# EAGLE design MJ818 rev.5b - SN Mini2 (EAGLE 9.6.2)
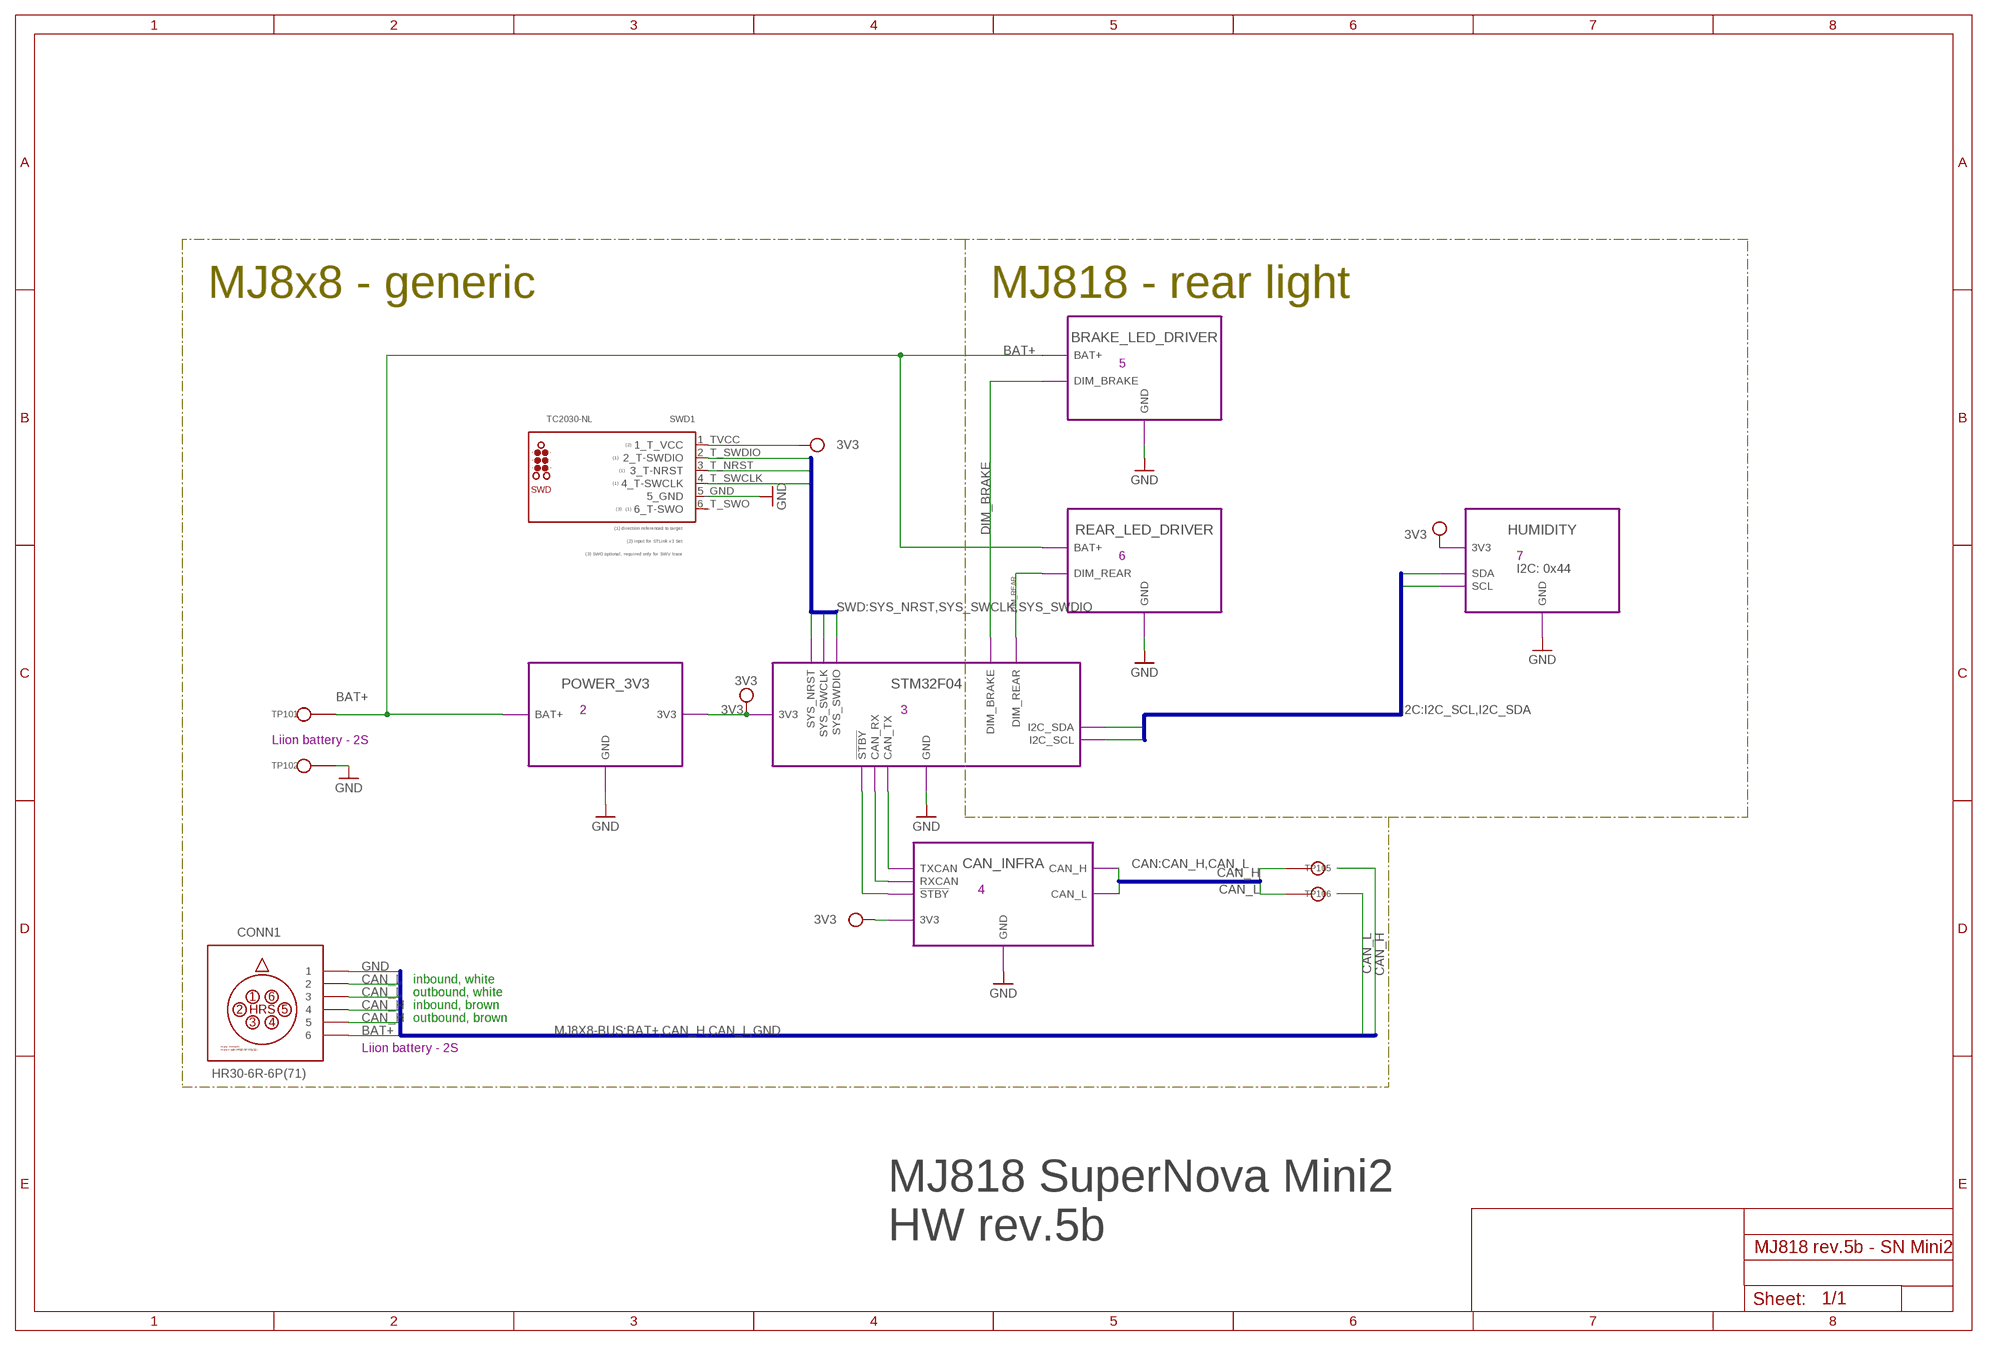
[diagram p0: schematic, sheet 1]

## Parts
CONN1  HR30-6R-6P(71)  HR-30-6R-6X  (no package)
SWD1  TC2030-NL  TC2030  [TC2030-NL]
TP101  LiIon + Terminal  TPTH-0.9  [TH-0.9]
TP102  LiIon - Terminal  TPTH-0.9  [TH-0.9]
TP105  CAN high  TPTH-0.9  [TH-0.9]
TP106  CAN low  TPTH-0.9  [TH-0.9]

## Module instances
POWER_3V3 = POWER_3V3 (part numbers offset by 200)
STM32F04 = STM32 (part numbers offset by 300)
CAN_INFRA = CAN_INFRA (part numbers offset by 400)
BRAKE_LED_DRIVER = LED_DRIVER_BRAKE-LIGHT (part numbers offset by 500)
REAR_LED_DRIVER = LED_DRIVER_REAR-LIGHT (part numbers offset by 600)
HUMIDITY = HUMIDITY (part numbers offset by 700)

## Nets
3V3 [3V3]: SWD1.1_TVCC(1_T_VCC) ; port STM32F04.3V3 POWER_3V3.3V3 CAN_INFRA.3V3 HUMIDITY.3V3
!STBY! [signal]: port CAN_INFRA.!STBY! STM32F04.!STBY!
BAT+ [BAT+]: CONN1.6 TP101.P$1(TP$1) ; port POWER_3V3.BAT+ BRAKE_LED_DRIVER.BAT+ REAR_LED_DRIVER.BAT+
CAN_H [signal]: CONN1.4 CONN1.5 TP105.P$1(TP$1) ; port CAN_INFRA.CAN_H
CAN_L [signal]: CONN1.2 CONN1.3 TP106.P$1(TP$1) ; port CAN_INFRA.CAN_L
CAN_RX [signal]: port CAN_INFRA.RXCAN STM32F04.CAN_RX
CAN_TX [signal]: port CAN_INFRA.TXCAN STM32F04.CAN_TX
DIM_BRAKE [signal]: port STM32F04.DIM_BRAKE BRAKE_LED_DRIVER.DIM_BRAKE
DIM_REAR [signal]: port STM32F04.DIM_REAR REAR_LED_DRIVER.DIM_REAR
GND: CONN1.1 SWD1.5_GND TP102.P$1(TP$1) ; port STM32F04.GND POWER_3V3.GND CAN_INFRA.GND BRAKE_LED_DRIVER.GND REAR_LED_DRIVER.GND HUMIDITY.GND
I2C_SCL [signal]: port STM32F04.I2C_SCL HUMIDITY.SCL
I2C_SDA [signal]: port STM32F04.I2C_SDA HUMIDITY.SDA
SYS_NRST [signal]: SWD1.3_T_NRST(3_T-NRST) ; port STM32F04.SYS_NRST
SYS_SWCLK [signal]: SWD1.4_T_SWCLK(4_T-SWCLK) ; port STM32F04.SYS_SWCLK
SYS_SWDIO [signal]: SWD1.2_T_SWDIO(2_T-SWDIO) ; port STM32F04.SYS_SWDIO
Unconnected: SWD1.6_T_SWO(6_T-SWO)

## Buses
CAN:CAN_H,CAN_L
SWD:SYS_NRST,SYS_SWCLK,SYS_SWDIO
MJ8X8-BUS:BAT+,CAN_H,CAN_L,GND
I2C:I2C_SCL,I2C_SDA

## Notes on the sheet
- MJ8x8 - generic | MJ818 - rear light
- 5
- 6 | 7
- I2C: 0x44
- 2 | 3
- Liion battery - 2S
- 4
- inbound, white
- outbound, white
- inbound, brown
- outbound, brown
- Liion battery - 2S
- MJ818 SuperNova Mini2
  HW rev.5b

## Library data of the parts
CONN1 = HR30-6R-6P - PushPull Receptacle:HR-30-6R-6X
SWD1 = tag-connect:TC2030: TC2030 pad no. Function STLink v3 CN1 pin no. Function 1 Reserved (1) 2 Reserved (1) 1 T_Vcc 3 T_Vcc (2) 2 T_SWDIO 4 T_JTMS/T_SWDIO 5 GND 4 T_SWCLK 6 T_JCLK / T_SWCLK 5 GND 7 GND 6 8 T_JTDO / T_SWO (3) 9 T_JRCLK (4) / NC (5) 10 T_JTDI / NC (5) 11 GNDDetect (6) 3 T_NRST 12 T_NRST 13 T_VCP_RX (7) 14 T_VCP_TX (2) (1) Do not connect to the target (2) Input for STLINK-V3SET (3) SWO is optional, required only for Serial Wire Viewer (SWV) trace (4) Optional loopback of T_JCLK on the target side, required if loopback is removed on the STLINK-V3SET side (5) NC means not required for the SWD connection (6) Tied to GND by STLINK-V3SET firmware; may be used by the target for detection of the tool (7) Output for STLINK-V3SET
TP101 TP102 TP105 TP106 = signal testpoint:TP

## Module POWER_3V3
Ports: GND(pwr) BAT+(pwr) 3V3(pwr)
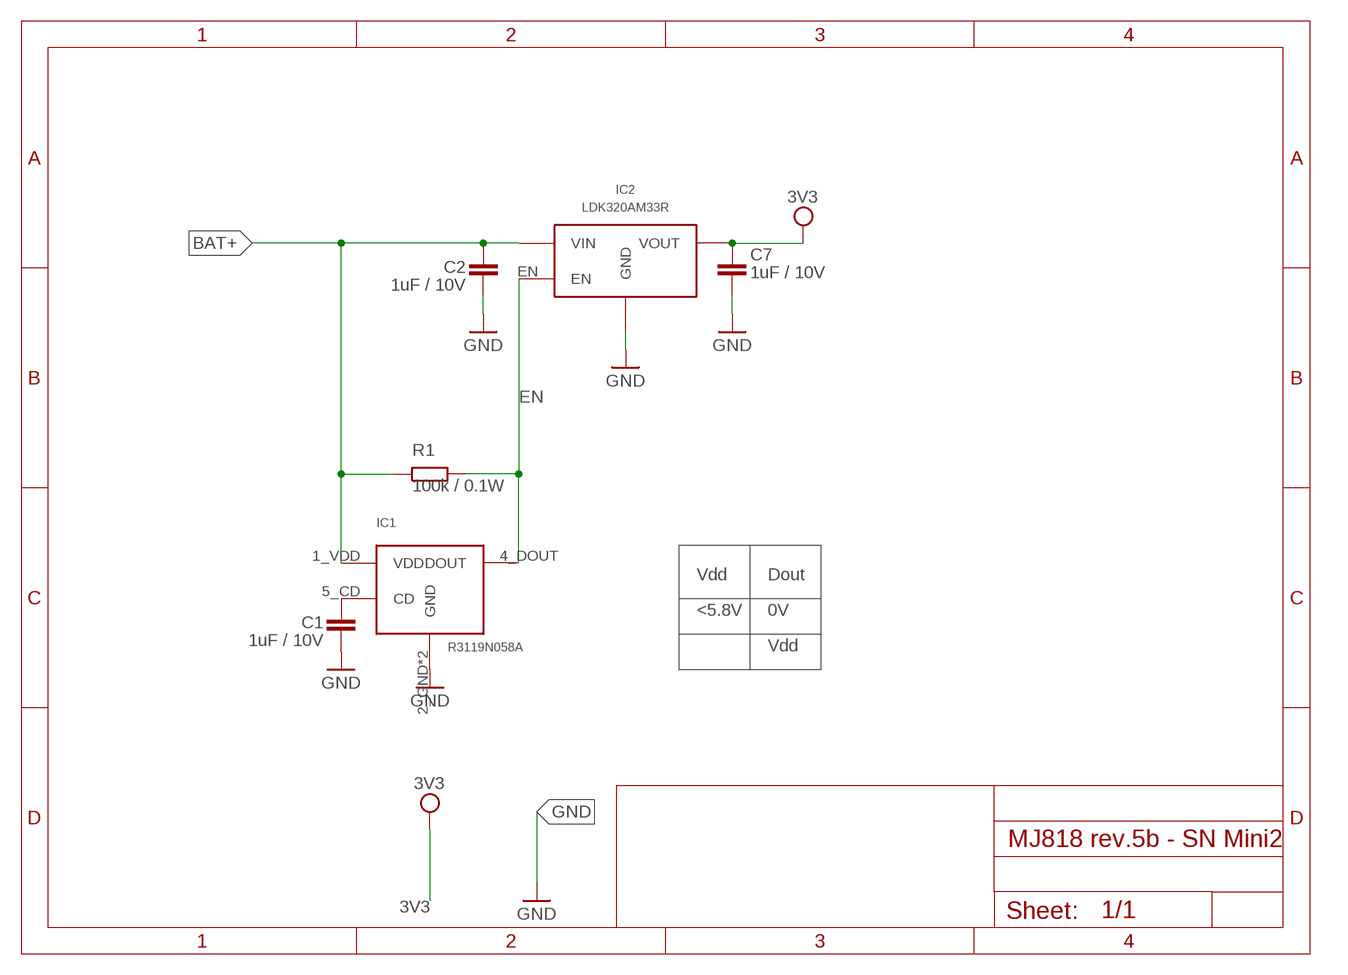
[diagram p1: schematic, module POWER_3V3, sheet 1]

### Parts
C1  1uF / 10V  C-EUC0402  [C0402]
C2  1uF / 10V  C-EUC0402  [C0402]
C7  1uF / 10V  C-EUC0402  [C0402]
IC1  R3119N058A  R3119XXXA  [SOT23-5]
IC2  LDK320AM33R  LDK320SOT-23-5L  [SOT-23-5L]
R1  100k / 0.1W  R-EU_R0402  [R0402]

### Nets
3V3: C7.2 IC2.OUT(VOUT)
BAT+ [BAT+]: C2.1 IC1.1_VDD(VDD) IC2.IN(VIN) R1.1
CD [signal]: C1.1 IC1.5_CD(CD)
EN [signal]: IC1.4_DOUT(DOUT) IC2.EN R1.2
GND: C1.2 C2.2 C7.1 IC1.2_GND(GND) IC1.3_GND(GND) IC2.GND

### Notes on the sheet
- Vdd | Dout
- <5.8V | 0V
- Vdd

### Library data of the parts
C1 C2 C7 = rcl:C-EU: CAPACITOR, European symbol; SPICEPREFIX: C
IC1 = R3119x - Input Voltage Detector:R3119XXXA
IC2 = LDK320 5V LDO:LDK320
R1 = rcl:R-EU_: RESISTOR, European symbol; SPICEPREFIX: R

## Module STM32
Ports: GND(pwr) 3V3(pwr) SYS_NRST(in) SYS_SWCLK(io) SYS_SWDIO(io) CAN_RX(in) CAN_TX(out) !STBY!(out) DIM_REAR(out) DIM_BRAKE(out) I2C_SCL(out) I2C_SDA(io)
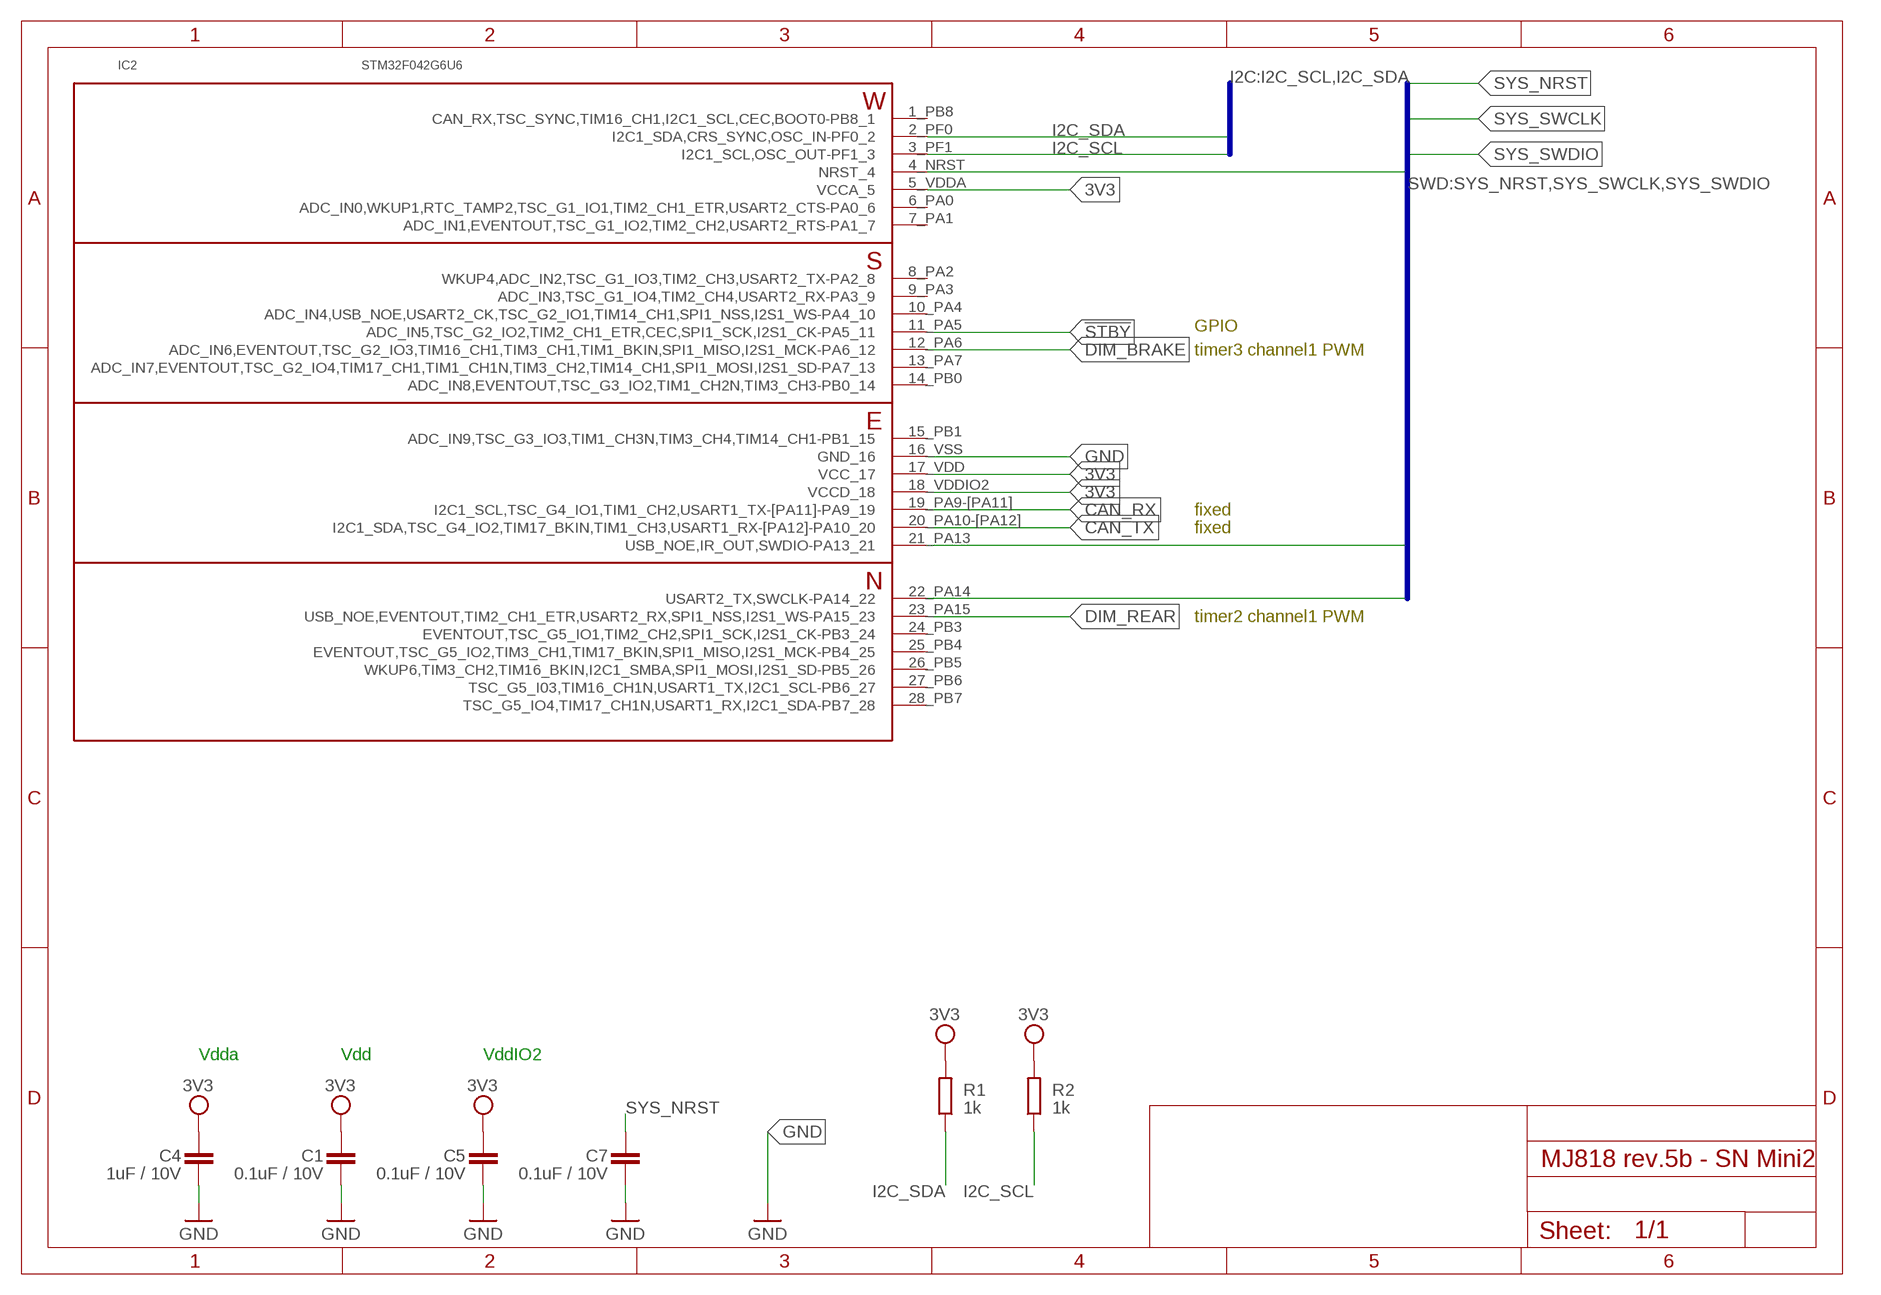
[diagram p2: schematic, module STM32, sheet 1]

### Parts
C1  0.1uF / 10V  C-EUC0402  [C0402]
C4  1uF / 10V  C-EUC0402  [C0402]
C5  0.1uF / 10V  C-EUC0402  [C0402]
C7  0.1uF / 10V  C-EUC0402  [C0402]
IC2  STM32F042G6U6  STM32F042G6  [UFQFPN-28]
R1  1k  R-EU_R0402  [R0402]
R2  1k  R-EU_R0402  [R0402]

### Nets
3V3 [3V3]: C1.2 C4.2 C5.2 IC2.5_VDDA(VCCA_5) IC2.17_VDD(VCC_17) IC2.18_VDDIO2(VCCD_18) R1.2 R2.2
!STBY!: IC2.11_PA5(ADC_IN5,TSC_G2_IO2,TIM2_CH1_ETR,CEC,SPI1_SCK,I2S1_CK-PA5_11)
CAN_RX: IC2.19_PA9-[PA11](I2C1_SCL,TSC_G4_IO1,TIM1_CH2,USART1_TX-[PA11]-PA9_19)
CAN_TX: IC2.20_PA10-[PA12](I2C1_SDA,TSC_G4_IO2,TIM17_BKIN,TIM1_CH3,USART1_RX-[PA12]-PA10_20)
DIM_BRAKE: IC2.12_PA6(ADC_IN6,EVENTOUT,TSC_G2_IO3,TIM16_CH1,TIM3_CH1,TIM1_BKIN,SPI1_MISO,I2S1_MCK-PA6_12)
DIM_REAR: IC2.23_PA15(USB_NOE,EVENTOUT,TIM2_CH1_ETR,USART2_RX,SPI1_NSS,I2S1_WS-PA15_23)
GND: C1.1 C4.1 C5.1 C7.1 IC2.16_VSS(GND_16)
I2C_SCL [signal]: IC2.3_PF1(I2C1_SCL,OSC_OUT-PF1_3) R2.1
I2C_SDA [signal]: IC2.2_PF0(I2C1_SDA,CRS_SYNC,OSC_IN-PF0_2) R1.1
SYS_NRST [signal]: C7.2 IC2.4_NRST(NRST_4)
SYS_SWCLK: IC2.22_PA14(USART2_TX,SWCLK-PA14_22)
SYS_SWDIO: IC2.21_PA13(USB_NOE,IR_OUT,SWDIO-PA13_21)
Unconnected: IC2.1_PB8(CAN_RX,TSC_SYNC,TIM16_CH1,I2C1_SCL,CEC,BOOT0-PB8_1) IC2.6_PA0(ADC_IN0,WKUP1,RTC_TAMP2,TSC_G1_IO1,TIM2_CH1_ETR,USART2_CTS-PA0_6) IC2.7_PA1(ADC_IN1,EVENTOUT,TSC_G1_IO2,TIM2_CH2,USART2_RTS-PA1_7) IC2.8_PA2(WKUP4,ADC_IN2,TSC_G1_IO3,TIM2_CH3,USART2_TX-PA2_8) IC2.9_PA3(ADC_IN3,TSC_G1_IO4,TIM2_CH4,USART2_RX-PA3_9) IC2.10_PA4(ADC_IN4,USB_NOE,USART2_CK,TSC_G2_IO1,TIM14_CH1,SPI1_NSS,I2S1_WS-PA4_10) IC2.13_PA7(ADC_IN7,EVENTOUT,TSC_G2_IO4,TIM17_CH1,TIM1_CH1N,TIM3_CH2,TIM14_CH1,SPI1_MOSI,I2S1_SD-PA7_13) IC2.14_PB0(ADC_IN8,EVENTOUT,TSC_G3_IO2,TIM1_CH2N,TIM3_CH3-PB0_14) IC2.15_PB1(ADC_IN9,TSC_G3_IO3,TIM1_CH3N,TIM3_CH4,TIM14_CH1-PB1_15) IC2.24_PB3(EVENTOUT,TSC_G5_IO1,TIM2_CH2,SPI1_SCK,I2S1_CK-PB3_24) IC2.25_PB4(EVENTOUT,TSC_G5_IO2,TIM3_CH1,TIM17_BKIN,SPI1_MISO,I2S1_MCK-PB4_25) IC2.26_PB5(WKUP6,TIM3_CH2,TIM16_BKIN,I2C1_SMBA,SPI1_MOSI,I2S1_SD-PB5_26) IC2.27_PB6(TSC_G5_I03,TIM16_CH1N,USART1_TX,I2C1_SCL-PB6_27) IC2.28_PB7(TSC_G5_IO4,TIM17_CH1N,USART1_RX,I2C1_SDA-PB7_28)

### Buses
SWD:SYS_NRST,SYS_SWCLK,SYS_SWDIO
I2C:I2C_SCL,I2C_SDA

### Notes on the sheet
- GPIO
- timer3 channel1 PWM
- fixed
- fixed
- timer2 channel1 PWM
- Vdda | Vdd | VddIO2

### Library data of the parts
C1 C4 C5 C7 = rcl:C-EU: CAPACITOR, European symbol; SPICEPREFIX: C
IC2 = STM32F042G6:STM32F042G6
R1 R2 = rcl:R-EU_: RESISTOR, European symbol; SPICEPREFIX: R

## Module CAN_INFRA
Ports: GND(pwr) 3V3(pwr) CAN_H(io) CAN_L(io) TXCAN(in) RXCAN(out) !STBY!(in)
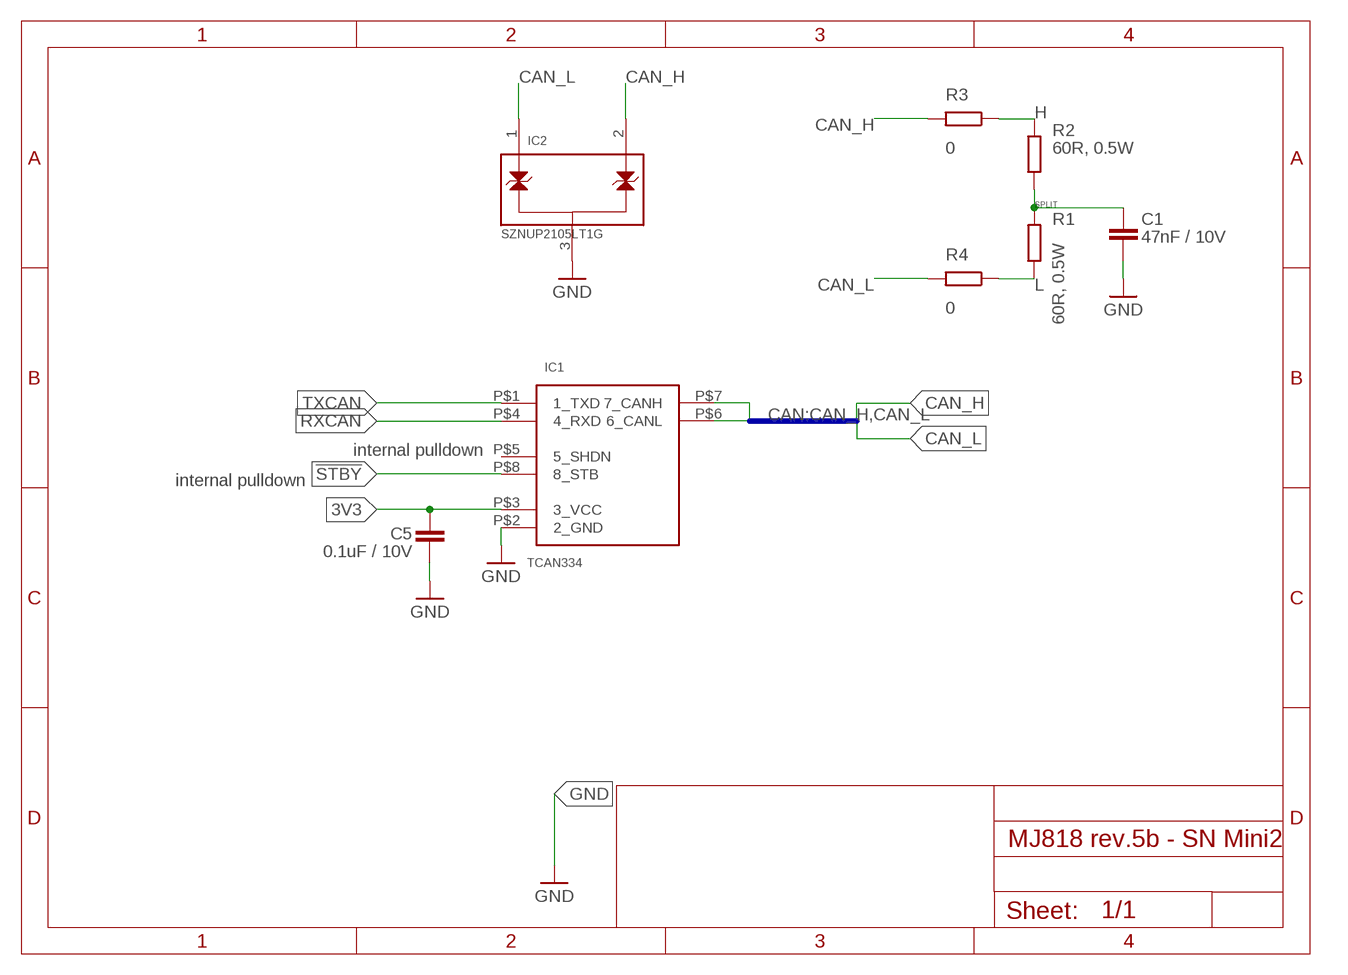
[diagram p3: schematic, module CAN_INFRA, sheet 1]

### Parts
C1  47nF / 10V  C-EUC0402  [C0402]
C5  0.1uF / 10V  C-EUC0402  [C0402]
IC1  TCAN334  CAN33X  [SOT23-8]
IC2  SZNUP2105LT1G  NUP2105L  [SOT-23-3]
R1  60R, 0.5W  R-EU_R0805  [R0805]
R2  60R, 0.5W  R-EU_R0805  [R0805]
R3  0  R-EU_R0402  [R0402]
R4  0  R-EU_R0402  [R0402]

### Nets
3V3 [3V3]: C5.1 IC1.P$3(3_VCC)
!STBY! [signal]: IC1.P$8(8_STB)
CAN_H [signal]: IC1.P$7(7_CANH) IC2.2(PIN2) R3.2
CAN_L [signal]: IC1.P$6(6_CANL) IC2.1(PIN1) R4.2
GND: C1.2 C5.2 IC1.P$2(2_GND) IC2.3(PIN3)
H [signal]: R2.2 R3.1
L [signal]: R1.1 R4.1
RXCAN [signal]: IC1.P$4(4_RXD)
SPLIT [signal]: C1.1 R1.2 R2.1
TXCAN [signal]: IC1.P$1(1_TXD)
Unconnected: IC1.P$5(5_SHDN)

### Buses
CAN:CAN_H,CAN_L

### Notes on the sheet
- internal pulldown
- internal pulldown

### Library data of the parts
C1 C5 = rcl:C-EU: CAPACITOR, European symbol; SPICEPREFIX: C
IC1 = TCAN33x - 3.3V CAN Transciever:CAN33X
IC2 = NUP2105L - 27V ESD Protection Diode:NUP2105L
R1-R4 = rcl:R-EU_: RESISTOR, European symbol; SPICEPREFIX: R

## Module LED_DRIVER_BRAKE-LIGHT
Ports: GND(pwr) DIM_BRAKE(in) BAT+(pwr)
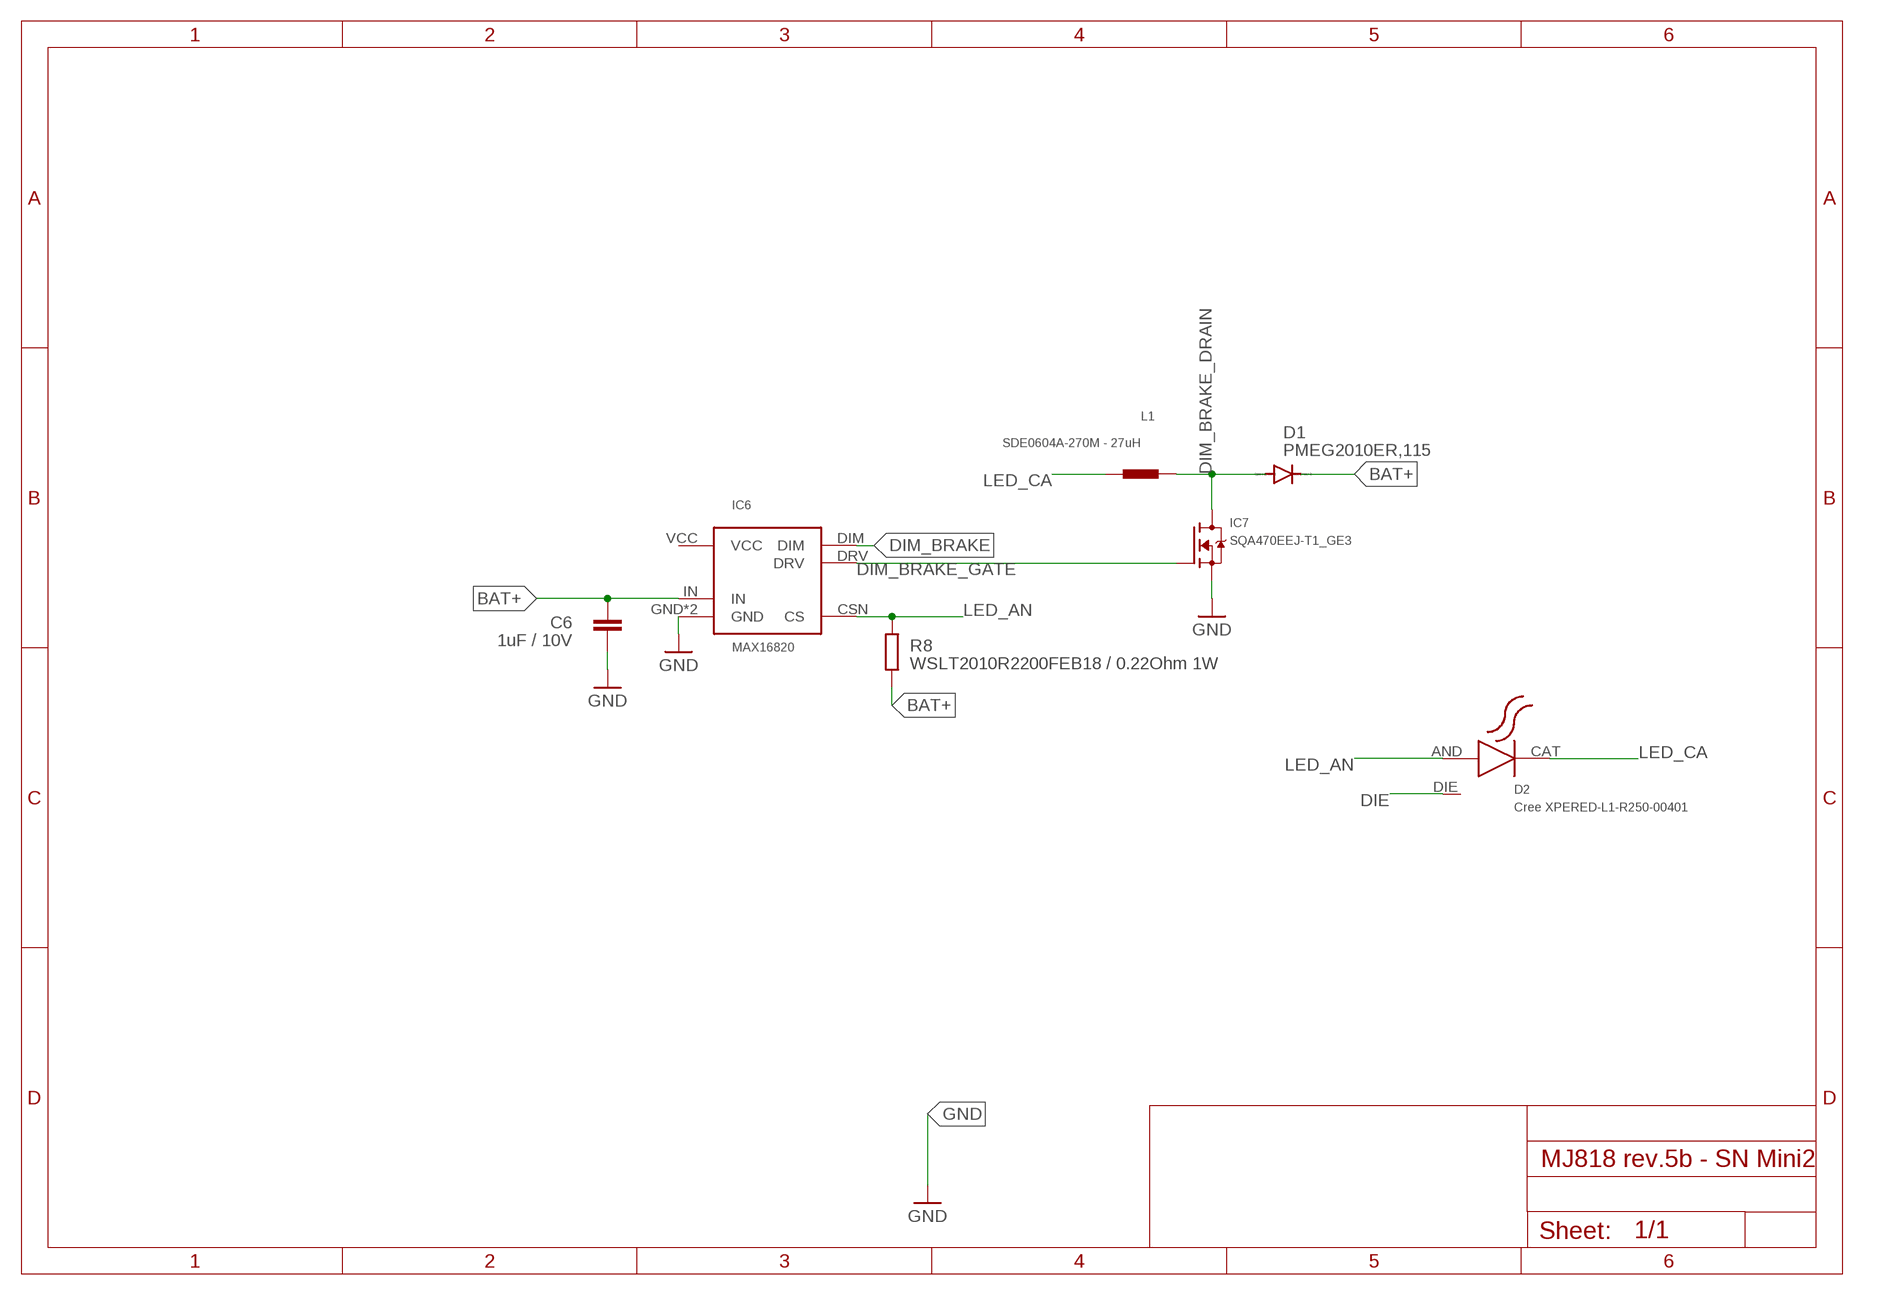
[diagram p4: schematic, module LED_DRIVER_BRAKE-LIGHT, sheet 1]

### Parts
C6  1uF / 10V  C-EUC0402  [C0402]
D1  PMEG2010ER,115  DIODE-SOD123  [SOD123]
D2  Cree XPERED-L1-R250-00401  XLAMPXPE-221789  [SMD]
IC6  MAX16820  [TDFN-6-EP]
IC7  SQA470EEJ-T1_GE3  SIA456DJ  [SC-70-6]
L1  SDE0604A-270M - 27uH  DE0604A-778075  [SMT]
R8  WSLT2010R2200FEB18 / 0.22Ohm 1W  R-EU_R2010  [R2010]

### Nets
BAT+ [BAT+]: C6.1 D1.C IC6.IN R8.2
DIE: D2.DIE
DIM_BRAKE [signal]: IC6.DIM
DIM_BRAKE_DRAIN [signal]: D1.A IC7.1D(D) IC7.2D(D) IC7.5D(D) IC7.6D(D) IC7.D L1.P$2
DIM_BRAKE_GATE [signal]: IC6.DRV IC7.3G(G)
GND: C6.2 IC6.GND IC6.GND1(GND) IC7.4S(S) IC7.S
LED_AN [BAT+]: D2.AND IC6.CSN(CS) R8.1
LED_CA [BAT+]: D2.CAT L1.P$1

### Power pins joined to a net without a drawn wire
VCC: IC6.VCC

### Library data of the parts
C6 = rcl:C-EU: CAPACITOR, European symbol; SPICEPREFIX: C
D1 = diode:DIODE-: DIODE
D2 = XLampXPE-221789:XLAMPXPE-221789
IC6 = MAX16820 LED Driver, constant current:MAX16820
IC7 = SIA456DJ-T1-GE3  N-Fet:SIA456DJ
L1 = DE0604A-778075 - Inductor:DE0604A-778075
R8 = rcl:R-EU_: RESISTOR, European symbol; SPICEPREFIX: R

## Module LED_DRIVER_REAR-LIGHT
Ports: GND(pwr) BAT+(pwr) DIM_REAR(in)
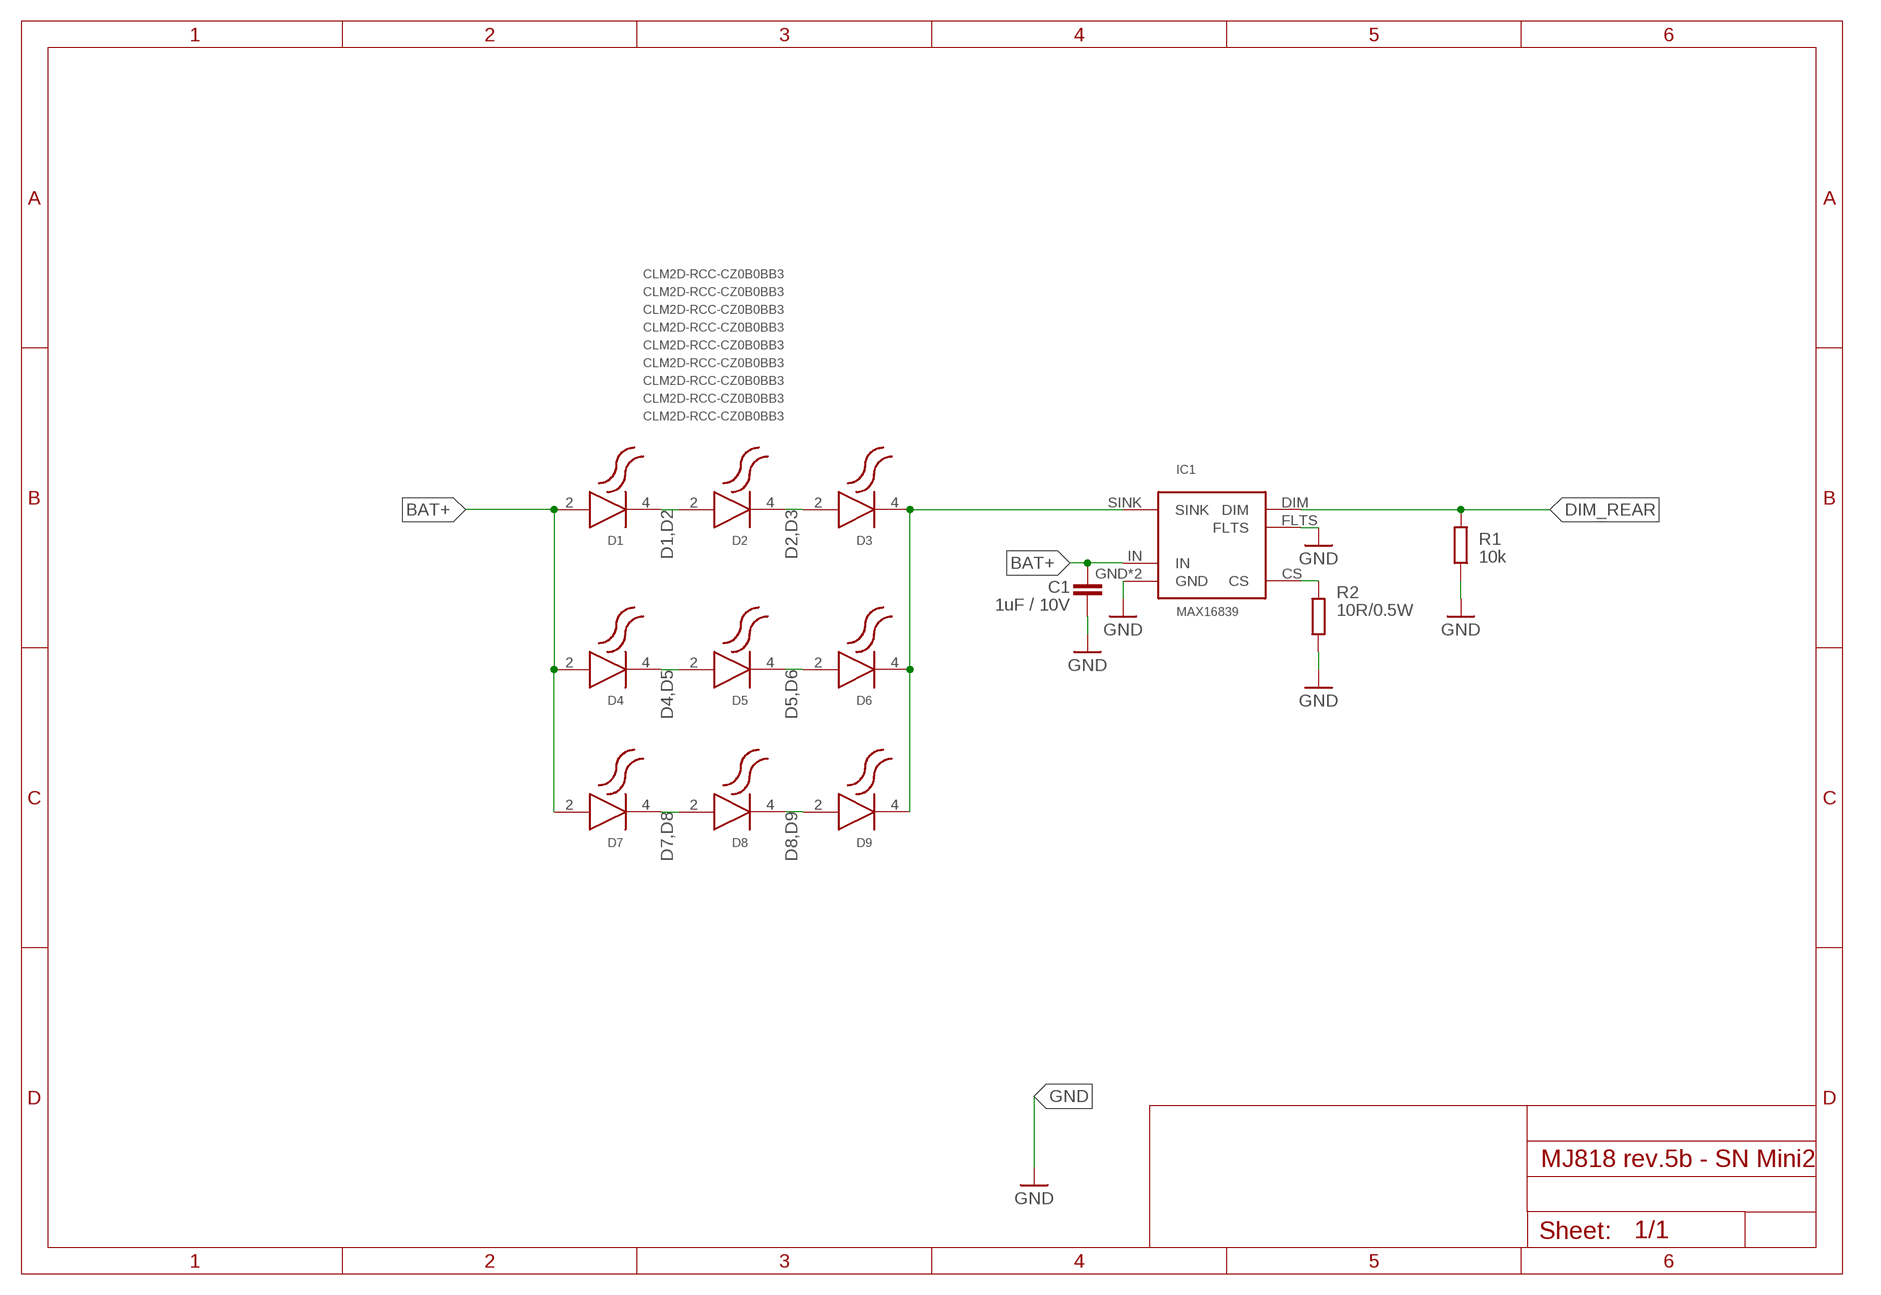
[diagram p5: schematic, module LED_DRIVER_REAR-LIGHT, sheet 1]

### Parts
C1  1uF / 10V  C-EUC0402  [C0402]
D1  CLM2D-RCC-CZ0B0BB3  1374-CLM2D-RCC-ACC-1064252  [SMD]
D2  CLM2D-RCC-CZ0B0BB3  1374-CLM2D-RCC-ACC-1064252  [SMD]
D3  CLM2D-RCC-CZ0B0BB3  1374-CLM2D-RCC-ACC-1064252  [SMD]
D4  CLM2D-RCC-CZ0B0BB3  1374-CLM2D-RCC-ACC-1064252  [SMD]
D5  CLM2D-RCC-CZ0B0BB3  1374-CLM2D-RCC-ACC-1064252  [SMD]
D6  CLM2D-RCC-CZ0B0BB3  1374-CLM2D-RCC-ACC-1064252  [SMD]
D7  CLM2D-RCC-CZ0B0BB3  1374-CLM2D-RCC-ACC-1064252  [SMD]
D8  CLM2D-RCC-CZ0B0BB3  1374-CLM2D-RCC-ACC-1064252  [SMD]
D9  CLM2D-RCC-CZ0B0BB3  1374-CLM2D-RCC-ACC-1064252  [SMD]
IC1  MAX16839  MAX16839  [TDFN-6-EP]
R1  10k  R-EU_R0402  [R0402]
R2  10R/0.5W  R-EU_R1206  [R1206]

### Nets
BAT+ [BAT+]: C1.2 D1.2(A) D4.2(A) D7.2(A) IC1.IN
CS [BAT+]: IC1.CS R2.1
D1,D2 [BAT+]: D1.4(C) D2.2(A)
D2,D3 [BAT+]: D2.4(C) D3.2(A)
D4,D5 [BAT+]: D4.4(C) D5.2(A)
D5,D6 [BAT+]: D5.4(C) D6.2(A)
D7,D8 [BAT+]: D7.4(C) D8.2(A)
D8,D9 [BAT+]: D8.4(C) D9.2(A)
DIM_REAR [signal]: IC1.DIM R1.2
GND: C1.1 IC1.FLTS IC1.GND IC1.GND1(GND) R1.1 R2.2
SINK [BAT+]: D3.4(C) D6.4(C) D9.4(C) IC1.SINK

### Library data of the parts
C1 = rcl:C-EU: CAPACITOR, European symbol; SPICEPREFIX: C
D1-D9 = 1374-CLM2D-RCC-ACC-1064252 - Red SMD LED:1374-CLM2D-RCC-ACC-1064252
IC1 = MAX16839 LED Driver, constant current:MAX16839
R1 R2 = rcl:R-EU_: RESISTOR, European symbol; SPICEPREFIX: R

## Module HUMIDITY
Ports: GND(pwr) 3V3(pwr) SCL(in) SDA(io)
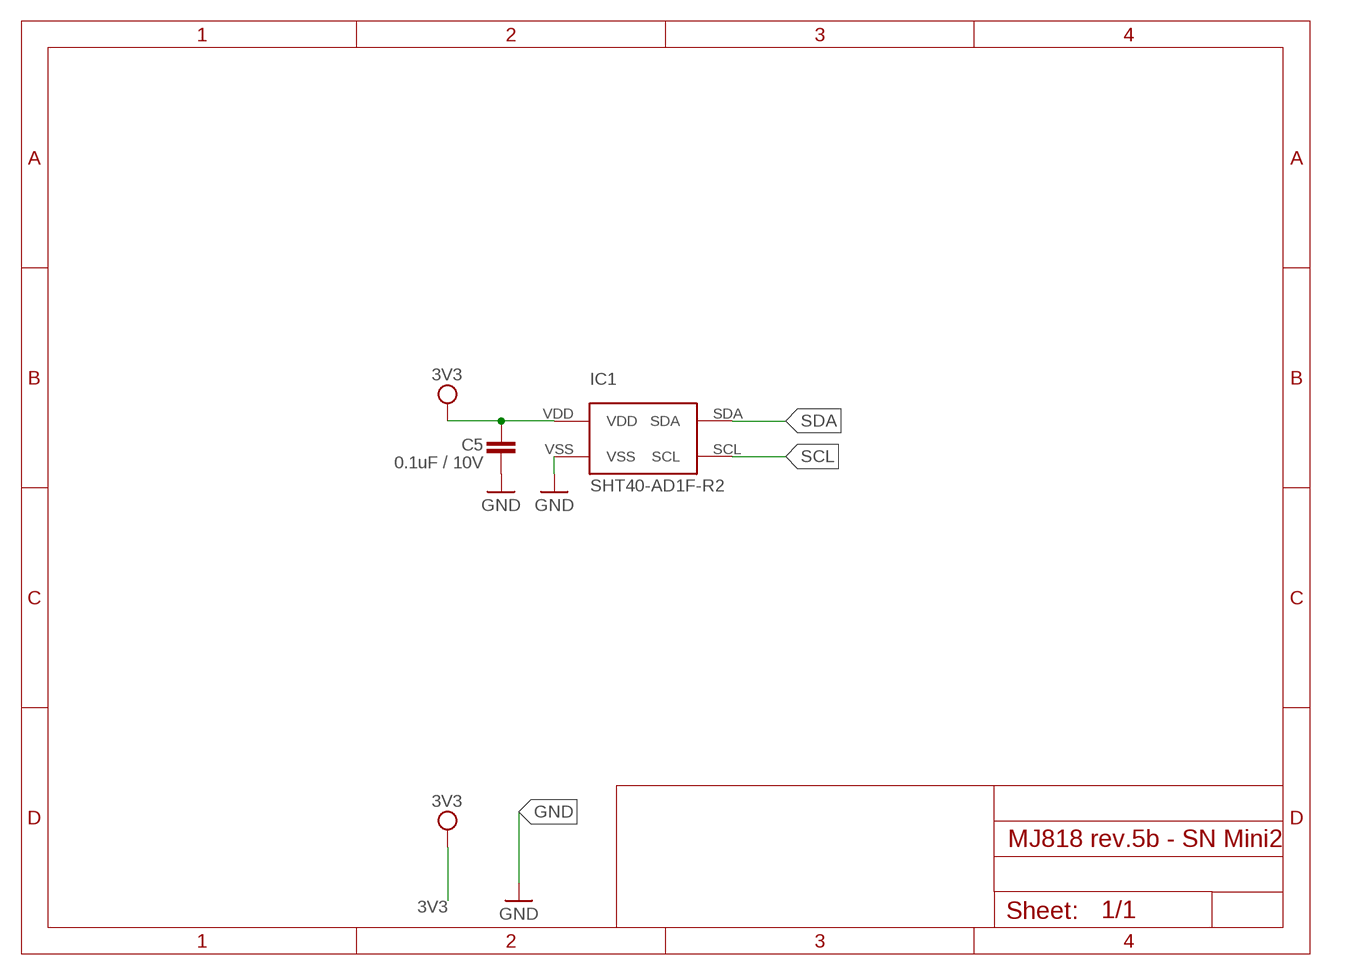
[diagram p6: schematic, module HUMIDITY, sheet 1]

### Parts
C5  0.1uF / 10V  C-EUC0402  [C0402]
IC1  SHT40-AD1F-R2  SHT40  [SMD]

### Nets
3V3 [3V3]: C5.1 IC1.VDD
GND: C5.2 IC1.VSS
SCL [signal]: IC1.SCL
SDA [signal]: IC1.SDA

### Library data of the parts
C5 = rcl:C-EU: CAPACITOR, European symbol; SPICEPREFIX: C
IC1 = SHT40-AD1F - Humidity Sensor:SHT40

## Net classes
0 GND: width 0.25 mm, drill 0.35 mm, clearance 0.19 mm
1 BAT+: width 0.5 mm, drill 0.35 mm, clearance 0.19 mm
3 signal: width 0.25 mm, drill 0.35 mm, clearance 0.19 mm
4 3V3: width 0.25 mm, drill 0.35 mm, clearance 0.19 mm

## Board
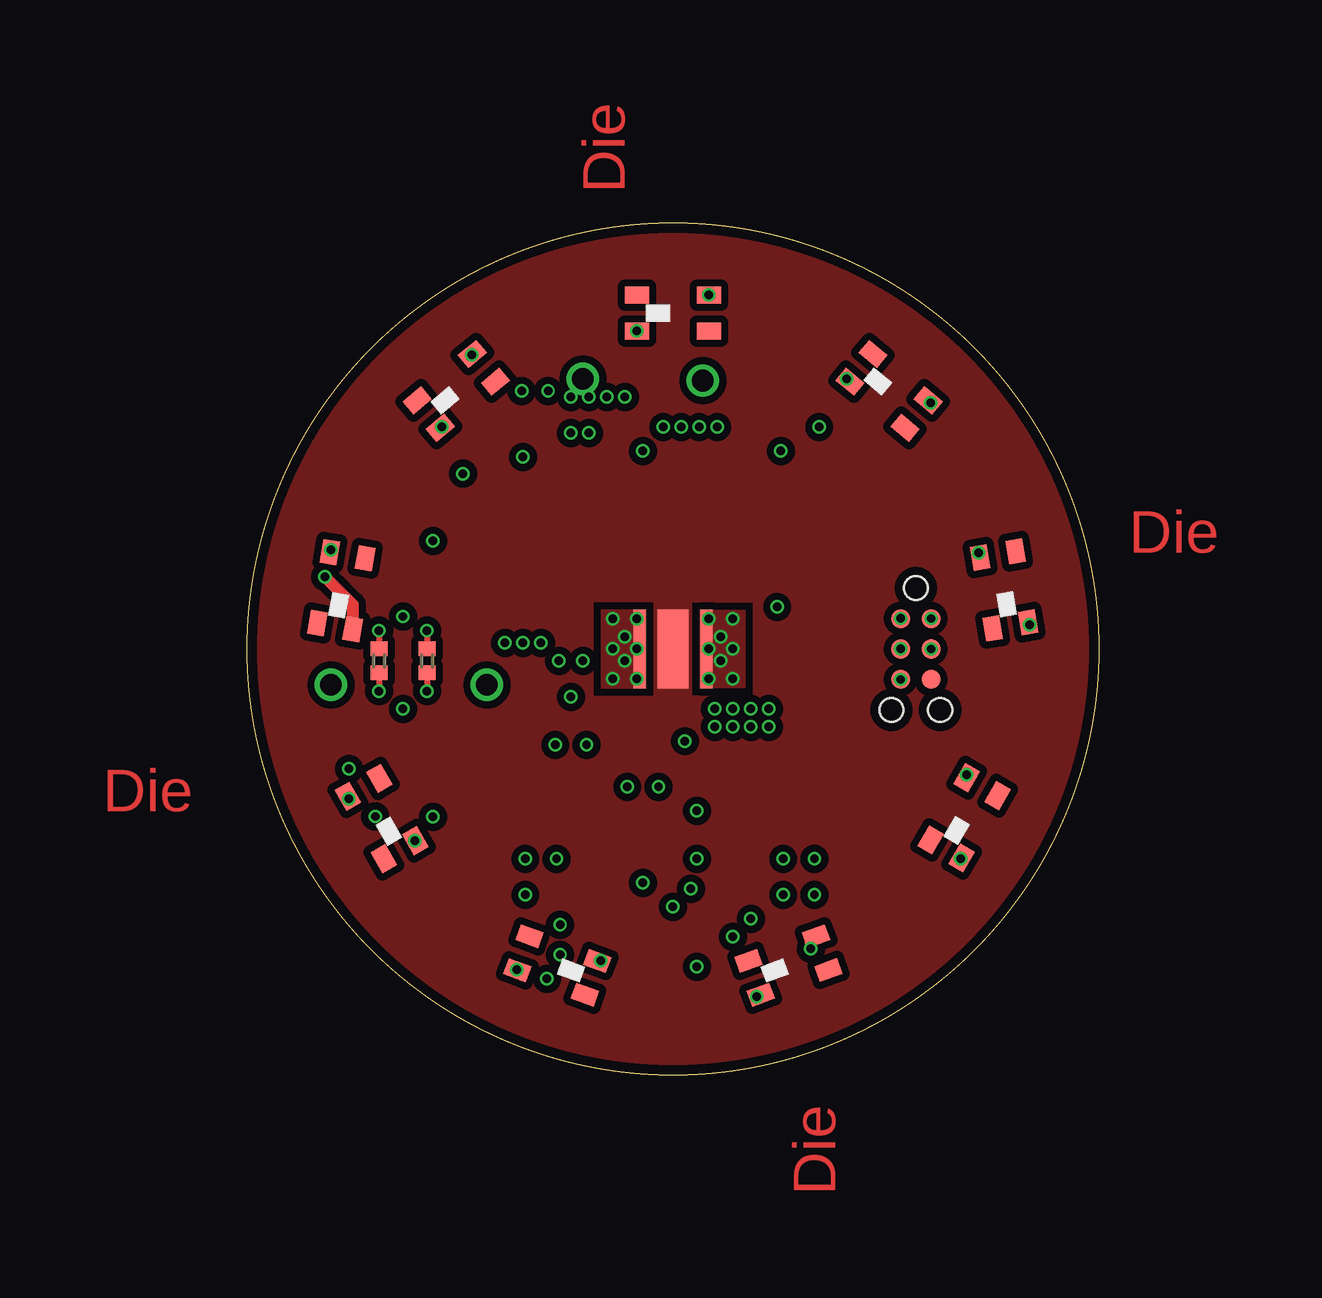
[diagram p7: board, top side]
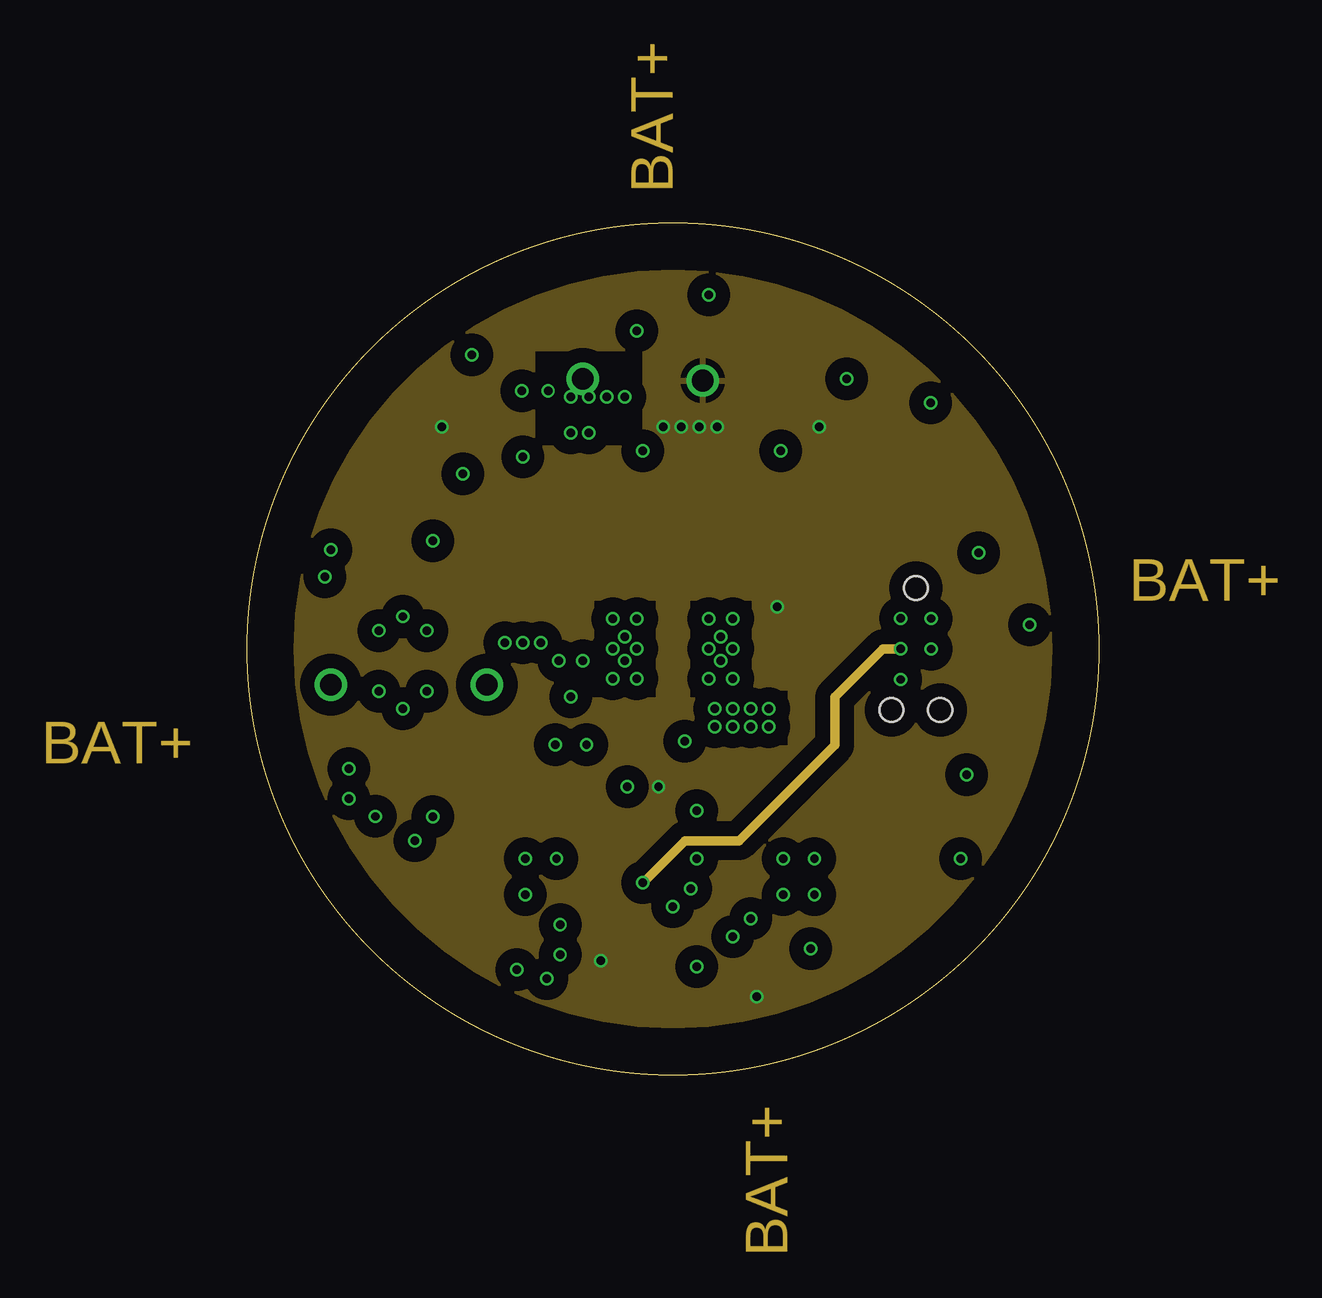
[diagram p8: board, inner layer Route2]
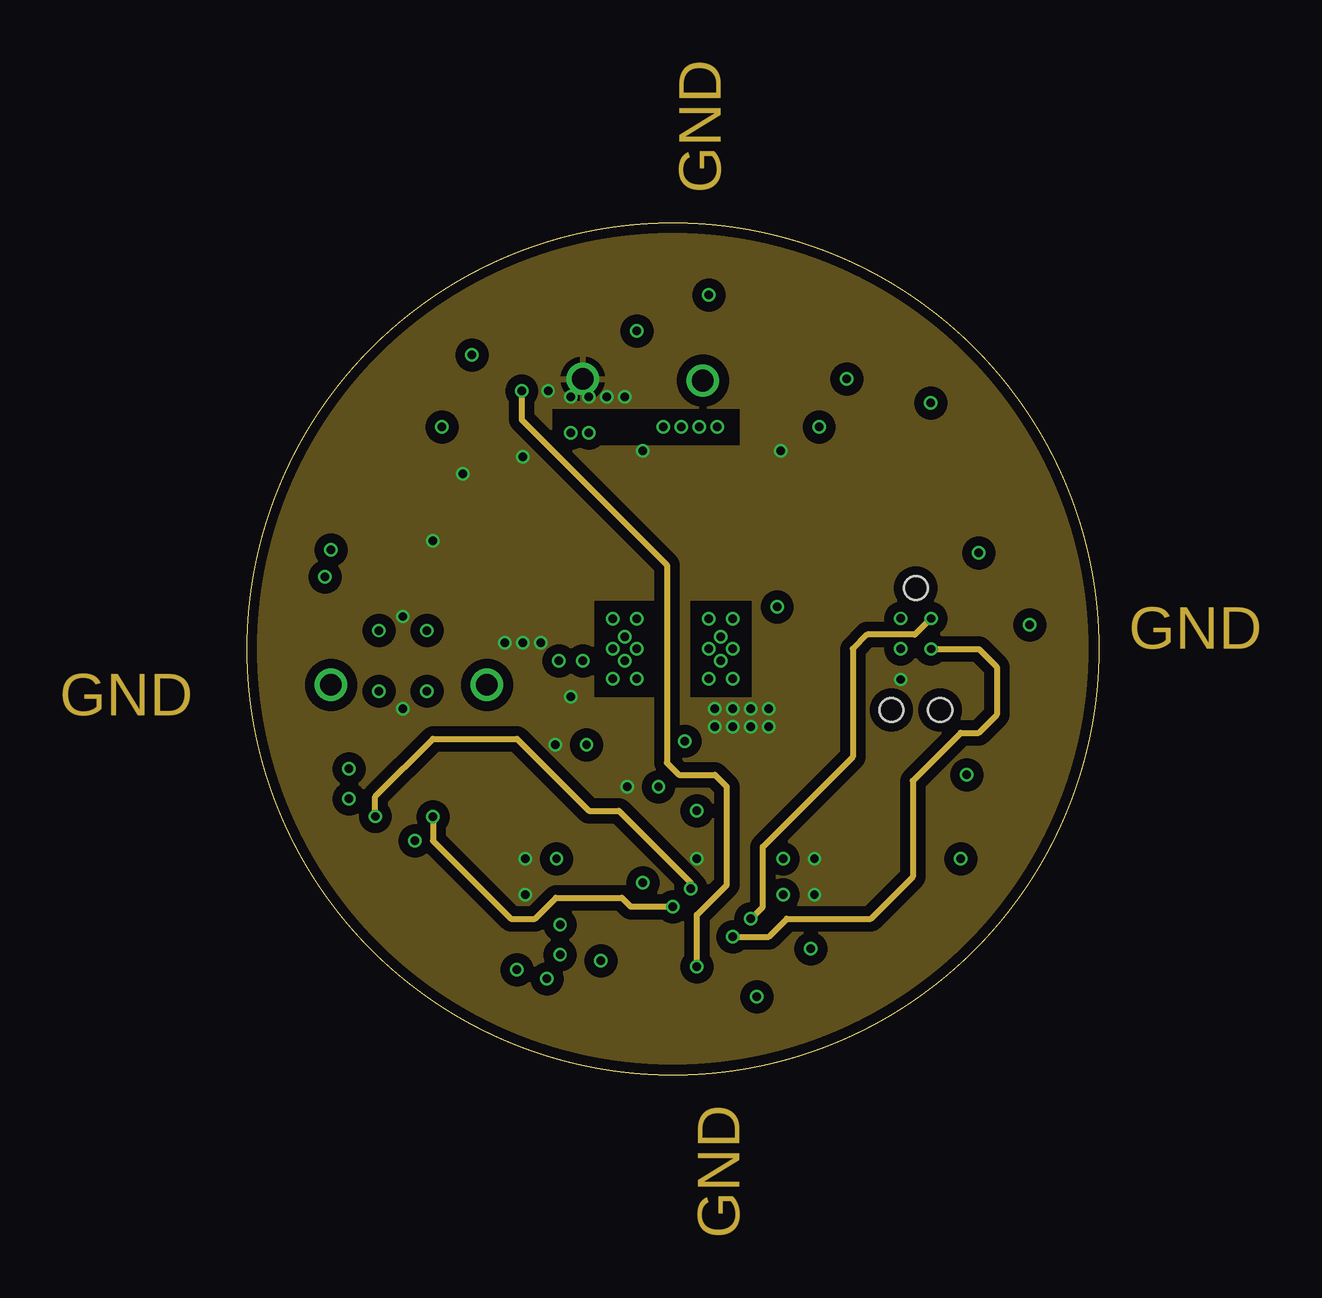
[diagram p9: board, inner layer Route3]
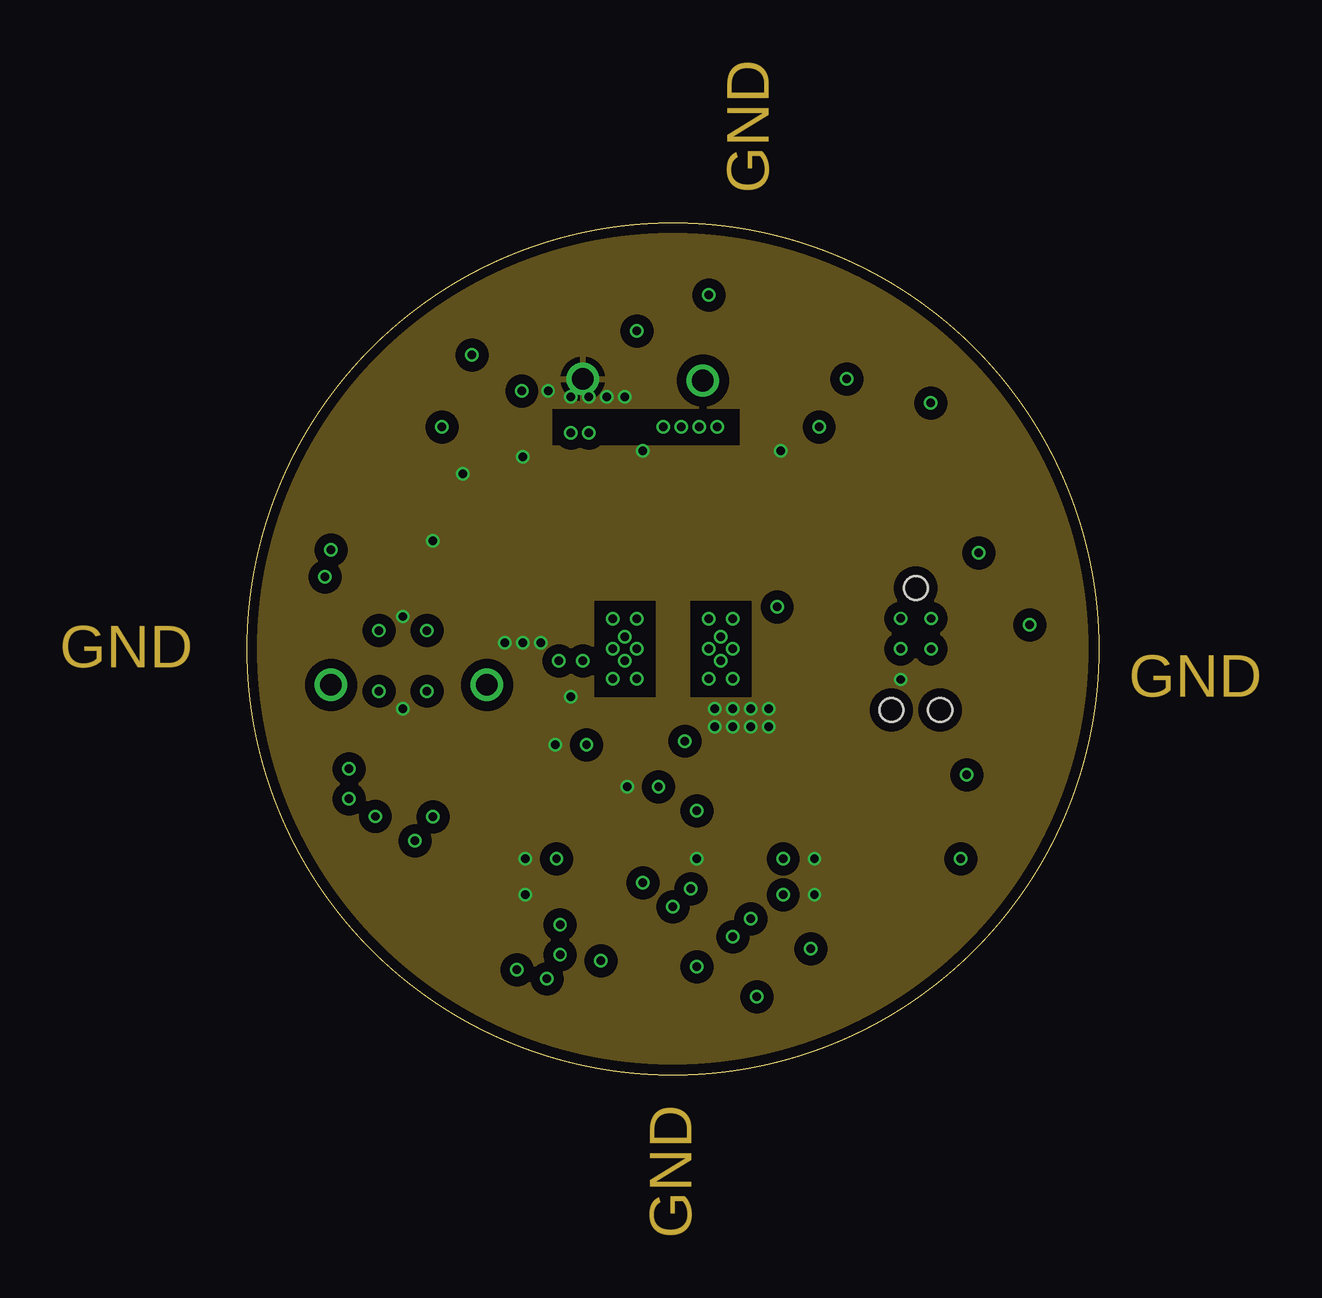
[diagram p10: board, inner layer Route14]
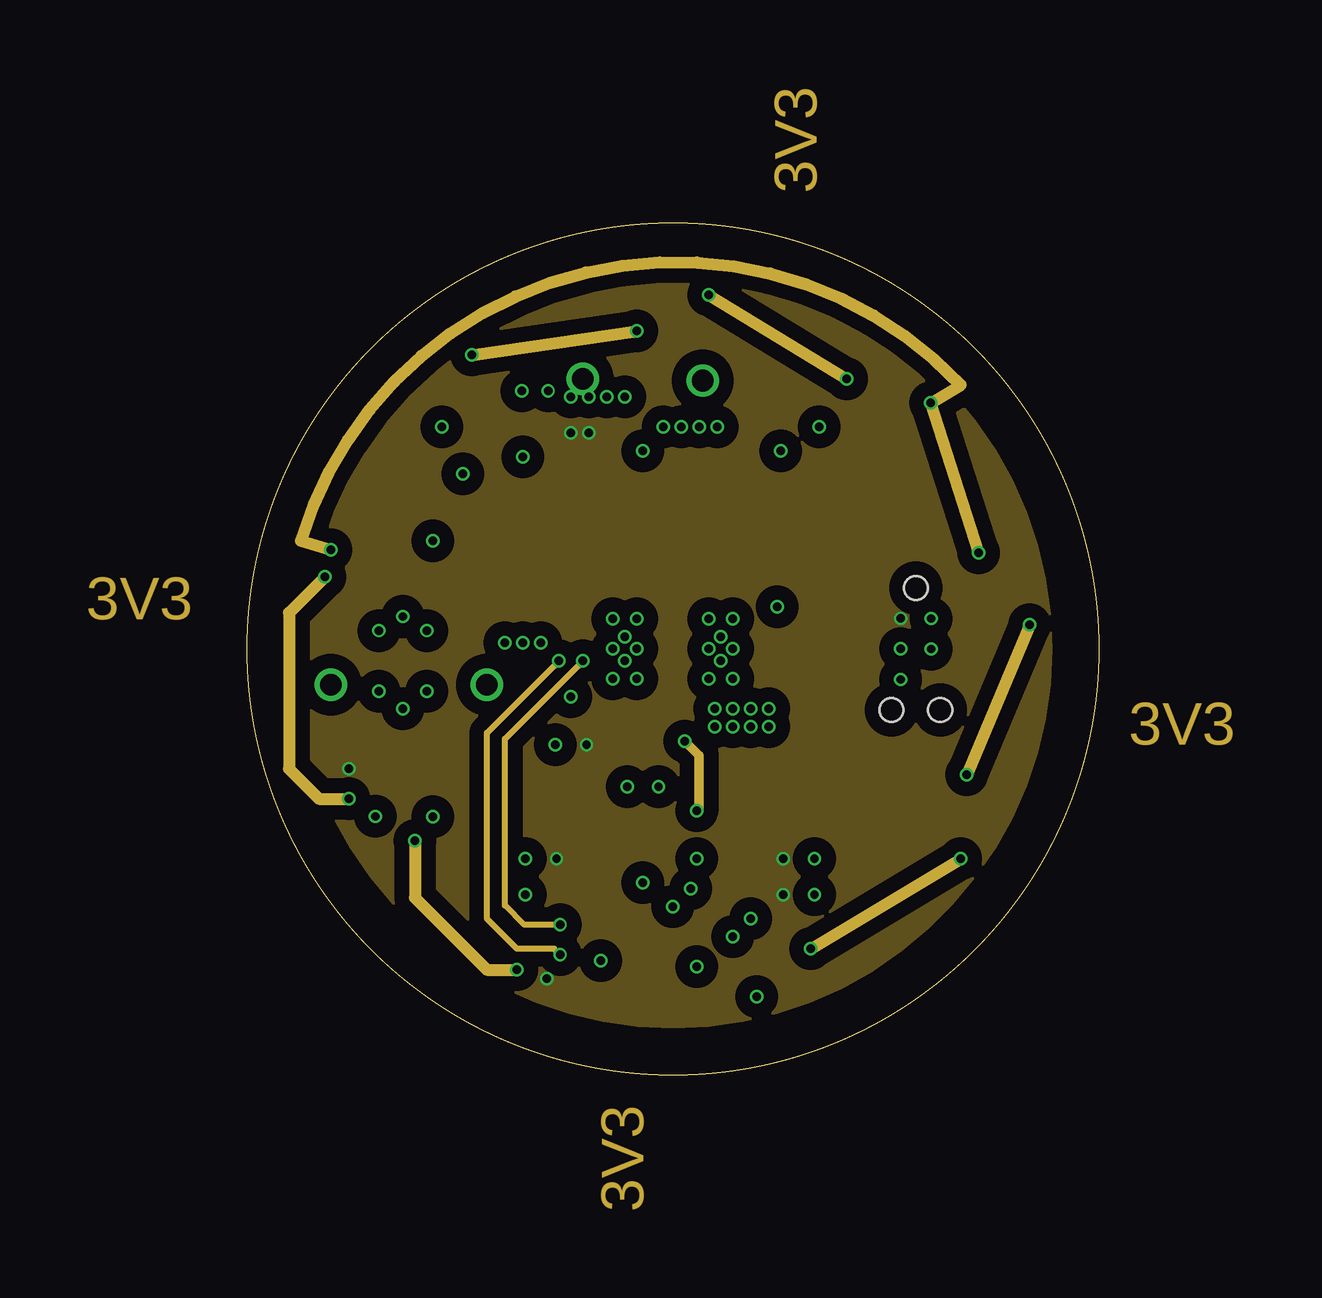
[diagram p11: board, inner layer Route15]
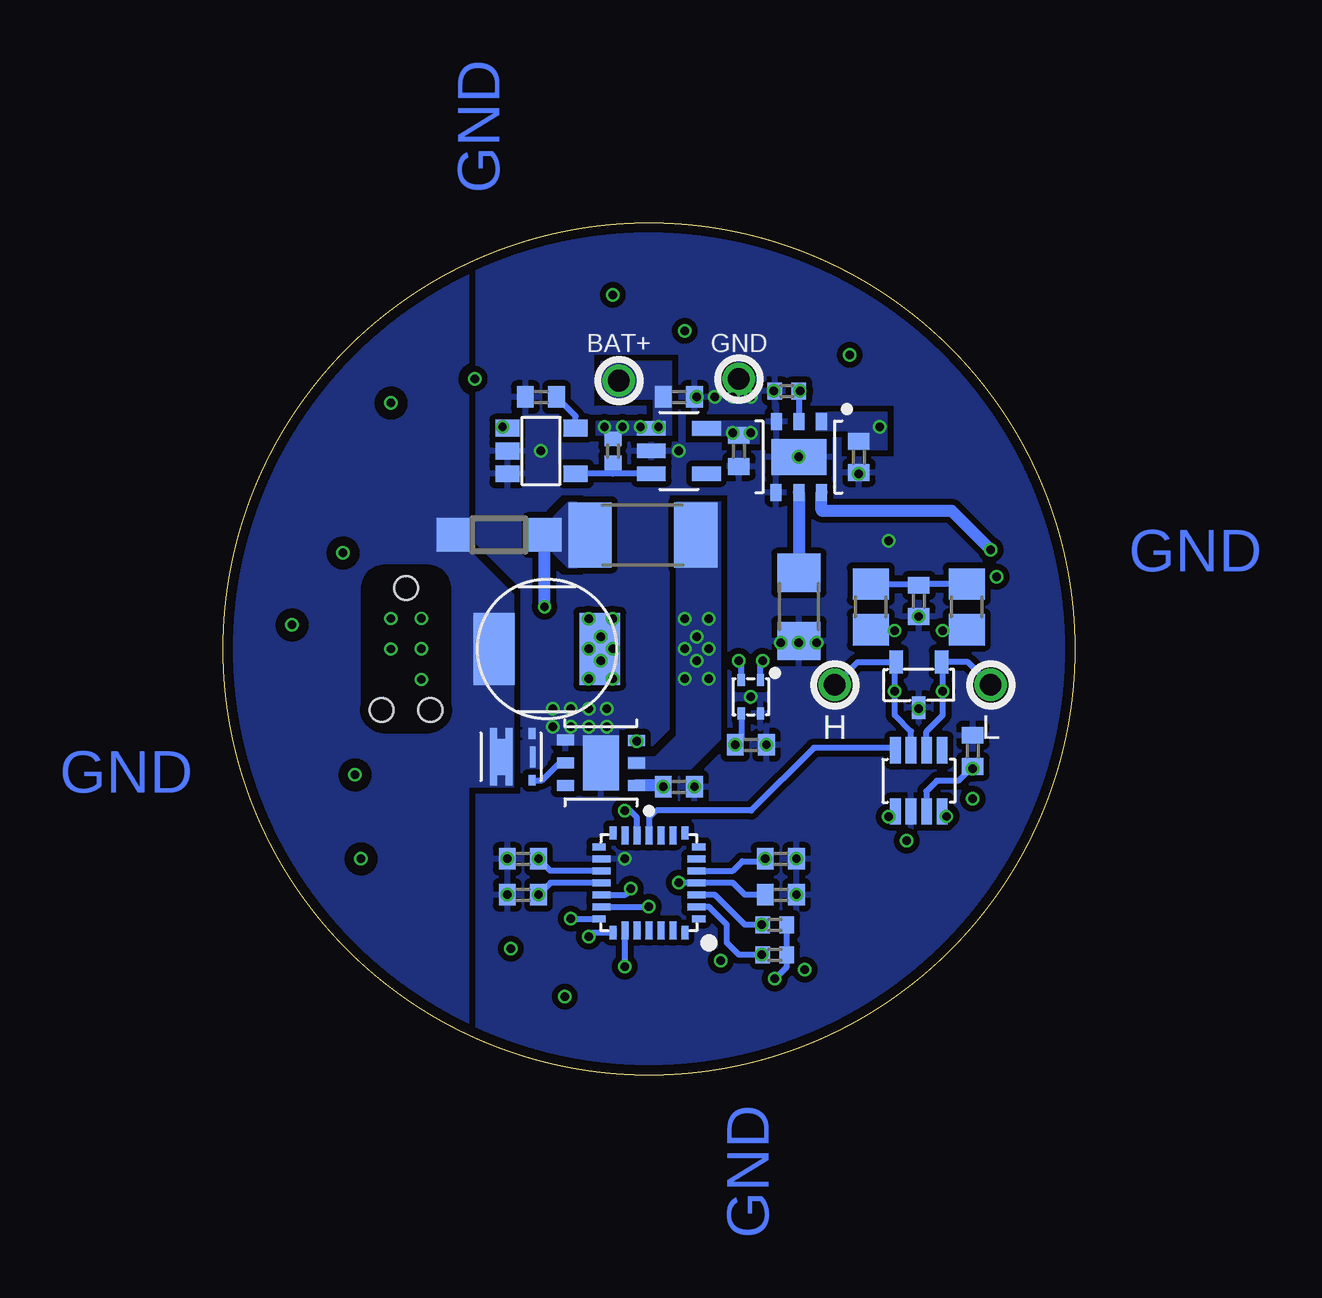
[diagram p12: board, bottom side, seen from below]

Size 35.5 x 35.5 mm. Coordinates in mm from the lower left corner, seen from the top.
Outline: circle at 17.75,17.75 radius 17.75
Copper layers (1*2*3*14*15*16): Top 0.0432mm / dielectric 0.1107mm / Route2 0.0175mm / dielectric 4mil / Route3 0.0175mm / dielectric 0.925575mm / Route14 0.0175mm / dielectric 4mil / Route15 0.0175mm / dielectric 0.1107mm / Bottom 0.0432mm
Design rules "oshpark-6layer": minimum track width 5mil, minimum drill 8mil, track to track 5mil, track to pad 5mil, pad to pad 5mil, via to via 5mil, smd to smd 5mil, copper to edge 15mil, drill to drill 6mil, minimum pad ring 4mil, minimum via ring 4mil, stop-mask expansion 1.5mil, vias tented up to drill 0mil, thermal gap 10mil
tKeepout: area 1,1 to 34.5,34.5
bKeepout: area 1,1 to 34.5,34.5
bRestrict: 4 lines

### Footprints (pad centres in the part's own frame; a part is rotated, then mirrored left to right if it is on the bottom)
C0402 = smd 0.7 x 0.9: 1 -0.65,0; 2 0.65,0
SOD123 = smd 1.4 x 1.4: A 1.9,0; C -1.9,0
SMD = smd 0.5 x 3.3: AND -1.4,0; CAT 1.4,0 | smd 1.3 x 3.3: DIE 0,0
SMD' = smd 1 x 0.7: 1 -1.5,0.75; 2 -1.5,-0.75; 3 1.5,-0.75; 4 1.5,0.75
SOT23-5 = smd 0.7 x 1: 1_VDD -0.95,-1.4; 2_GND 0,-1.4; 3_GND 0.95,-1.4; 4_DOUT 0.95,1.45; 5_CD -0.95,1.45
SOT-23-5L = smd 0.6 x 1.2: ADJ/NC -0.95,-1.15; EN -0.95,1.15; GND 0,1.15; IN 0.95,1.15; OUT 0.95,-1.15
UFQFPN-28 = smd 0.55 x 0.3: 1_PB8 -2.08,1.5; 7_PA1 -2.08,-1.5; 15_PB1 2.08,-1.5; 21_PA13 2.08,1.5 | smd 0.75 x 0.3: 2_PF0 -1.98,1; 3_PF1 -1.98,0.5; 4_NRST -1.98,0; 5_VDDA -1.98,-0.5; 6_PA0 -1.98,-1; 16_VSS 1.98,-1; 17_VDD 1.98,-0.5; 18_VDDIO2 1.98,0; 19_PA9-[PA11] 1.98,0.5; 20_PA10-[PA12] 1.98,1 | smd 0.3 x 0.55: 8_PA2 -1.5,-2.08; 14_PB0 1.5,-2.08; 22_PA14 1.5,2.08; 28_PB7 -1.5,2.08 | smd 0.3 x 0.75: 9_PA3 -1,-1.98; 10_PA4 -0.5,-1.98; 11_PA5 0,-1.98; 12_PA6 0.5,-1.98; 13_PA7 1,-1.98; 23_PA15 1,1.98; 24_PB3 0.5,1.98; 25_PB4 0,1.98; 26_PB5 -0.5,1.98; 27_PB6 -1,1.98
SOT23-8 = smd 0.45 x 1.1: P$1 -0.975,-1.275; P$2 -0.325,-1.275; P$3 0.325,-1.275; P$4 0.975,-1.275; P$5 0.975,1.275; P$6 0.325,1.275; P$7 -0.325,1.275; P$8 -0.975,1.275
SOT-23-3 = smd 0.56 x 0.95: 1 -0.95,-0.95; 2 0.95,-0.95; 3 0,0.95
TDFN-6-EP = smd 0.71 x 0.46: CSN -1.48,0; DIM -1.48,-0.94; DRV 1.48,0; GND1 1.48,-0.95; IN -1.48,0.94; VCC 1.48,0.95 | smd 1.5 x 2.3: GND 0,0
SC-70-6 = smd 0.45 x 0.3: 1D -0.975,0.725; 2D -0.975,0.075; 3G -0.975,-0.88; 4S 0.975,-0.88; 5D 0.975,0.075; 6D 0.975,0.725 | smd 1.5 x 0.95: D 0,0.4 | smd 0.87 x 0.23: S 0,-0.915
TDFN-6-EP' = smd 0.71 x 0.46: CS 1.48,0; DIM -1.48,0; FLTS -1.48,-0.94; GND1 1.48,-0.95; IN -1.48,0.94; SINK 1.48,0.95 | smd 1.5 x 2.3: GND 0,0
SMD'' = smd 0.5 x 0.3: SCL -0.7,-0.4; SDA -0.7,0.4; VDD 0.7,-0.4; VSS 0.7,0.4
SMT = smd 1.7 x 3: P$1 2.2,0; P$2 -2.2,0
R0402 = smd 0.6 x 0.7: 1 -0.5,0; 2 0.5,0
R0805 = smd 1.3 x 1.5: 1 -0.95,0; 2 0.95,0
R2010 = smd 1.8 x 2.7: 1 -2.2,0; 2 2.2,0
R1206 = smd 1.6 x 1.803: 1 -1.422,0; 2 1.422,0
TC2030-NL = smd 0.787 x 0.787: 1_TVCC 1.27,-0.635; 2_T_SWDIO 1.27,0.635; 3_T_NRST 2.54,-0.635; 4_T_SWCLK 2.54,0.635; 5_GND 3.81,-0.635; 6_T_SWO 3.81,0.635 | hole 0.991: 0,0; 5.08,-1.016; 5.08,1.016
TH-0.9 = drill 0.9: P$1 0,0

### Placement (x,y rotation side)
C201  1uF / 10V  [C0402]  22.25,28.25 180 bottom
C202  1uF / 10V  [C0402]  16.5,28.25 0 bottom
C207  1uF / 10V  [C0402]  14,26 90 bottom
C301  0.1uF / 10V  [C0402]  23,9 0 bottom
C304  1uF / 10V  [C0402]  12.25,9 180 bottom
C305  0.1uF / 10V  [C0402]  23,7.5 0 bottom
C307  0.1uF / 10V  [C0402]  12.25,7.5 180 bottom
C401  47nF / 10V  [C0402]  6.5,19.75 270 bottom
C405  0.1uF / 10V  [C0402]  4.25,13.5 90 bottom
C506  1uF / 10V  [C0402]  16.5,12 0 bottom
C601  1uF / 10V  [C0402]  9,25.75 90 bottom
C705  0.1uF / 10V  [C0402]  13.5,13.75 0 bottom
D501  PMEG2010ER,115  [SOD123]  24,22.5 180 bottom
D502  Cree XPERED-L1-R250-00401  [SMD]  17.75,17.75 0 top
D601  CLM2D-RCC-CZ0B0BB3  [SMD']  22.57,4.55 20 top
D602  CLM2D-RCC-CZ0B0BB3  [SMD']  29.89,10.71 60 top
D603  CLM2D-RCC-CZ0B0BB3  [SMD']  31.56,20.21 100 top
D604  CLM2D-RCC-CZ0B0BB3  [SMD']  12.93,4.55 160 top
D605  CLM2D-RCC-CZ0B0BB3  [SMD']  5.61,10.68 120 top
D606  CLM2D-RCC-CZ0B0BB3  [SMD']  3.93,20.18 80 top
D607  CLM2D-RCC-CZ0B0BB3  [SMD']  8.72,28.5 40 top
D608  CLM2D-RCC-CZ0B0BB3  [SMD']  17.75,31.75 0 top
D609  CLM2D-RCC-CZ0B0BB3  [SMD']  26.76,28.5 320 top
IC201  R3119N058A  [SOT23-5]  22.25,26 270 bottom
IC202  LDK320AM33R  [SOT-23-5L]  16.5,26 90 bottom
IC302  STM32F042G6U6  [UFQFPN-28]  17.75,8 180 bottom
IC401  TCAN334  [SOT23-8]  6.5,12.25 0 bottom
IC402  SZNUP2105LT1G  [SOT-23-3]  6.5,16.25 180 bottom
IC506  MAX16820  [TDFN-6-EP]  19.75,13 180 bottom
IC507  SQA470EEJ-T1_GE3  [SC-70-6]  23.5,13.25 90 bottom
IC601  MAX16839  [TDFN-6-EP']  11.5,25.75 270 bottom
IC701  SHT40-AD1F-R2  [SMD'']  13.5,15.75 270 bottom
L501  SDE0604A-270M - 27uH  [SMT]  22,17.75 0 bottom
R201  100k / 0.1W  [R0402]  19.25,26 270 bottom
R301  1k  [R0402]  12.5,5 0 bottom
R302  1k  [R0402]  12.5,6.25 0 bottom
R401  60R, 0.5W  [R0805]  4.5,19.5 90 bottom
R402  60R, 0.5W  [R0805]  8.5,19.5 270 bottom
R403  0  [R0402]  7.5,17.25 270 top
R404  0  [R0402]  5.5,17.25 270 top
R508  WSLT2010R2200FEB18 / 0.22Ohm 1W  [R2010]  18,22.5 180 bottom
R601  10k  [R0402]  12,28.5 0 bottom
R602  10R/0.5W  [R1206]  11.5,19.5 270 bottom
SWD1  27.88,20.29 270 top
TP101  19,28.93 0 bottom
TP102  14,29 0 bottom
TP105  10,16.25 0 bottom
TP106  3.5,16.25 180 bottom

### Tracks (layer width: path | path; a pad name or v marks a point on that pad's centre or on a via)
3V3  (via drill 0.35)
  Top 0.25: SWD1.1_TVCC
  Bottom 0.25: IC302.5_VDDA 14.25,8.5 13.85,8.9 13,8.9 C304.2 | IC302.17_VDD 21.85,8.5 C301.2 | IC302.18_VDDIO2 21.85,8 C305.2 | v12.5,4 12,4.5 R301.2 R302.2 | IC701.VDD 13.9,14 C705.1 | v4.25,12.75 C405.1 4.85,12.25 5.75,12.25 6.19,11.82 6.19,10.98 IC401.P$3
  other vias: 27.24,19.02 12.9,9 22.35,9 22.35,7.5 14.25,26.75 13.5,26.75 14.15,13.75
  pour Route15 (isolate 0.61): 33.5,17.75 arc90 17.75,33.5 arc90 2,17.75 arc90 17.75,2 arc90
  pour Bottom (no thermals): 14.45,26.3 13.15,26.3 13.15,27.25 15.95,27.25 15.95,26.65 14.45,26.65
!STBY!
  Bottom 0.25: IC302.11_PA5 17.71,10.02 17.71,10.73 17.44,11.01 13.49,11.01 10.88,13.62 7.47,13.62 IC401.P$8
BAT+  (via drill 0.35)
  Top 0.5: D601.2 21.32,3.25 v21.25,3.25 | v8.12,27 8.1,27 D607.2 | D604.2 v14.75,4.75
  Bottom 0.5: C506.1 17.21,12.06 IC506.IN | v22.1,19.5 D501.C | IC201.1_VDD 23.7,27 v23.85,27
  other vias: 17.15,12 17.35,27 18.1,27 18.85,27 19.6,27
  pour Bottom (no thermals): 20.75,23.88 21.12,23.88 21.75,23.25 21.75,21.75 21.12,21.12 20.75,21.12
  pour Route2 (isolate 0.61, rank 6): 33.5,17.75 arc90 17.75,33.5 arc90 2,17.75 arc90 17.75,2 arc90
  pour Bottom (no thermals): 19.75,29.75 16.8,29.75 16.8,26.65 19.95,26.65 19.95,27.25 17.55,27.25 17.55,28.15 19.75,28.15
  pour Bottom (no thermals): 9.45,26.05 7.8,26.05 7.8,27.6 10.8,27.6 10.8,26.85 9.45,26.85
BRAKE_LED_DRIVER:DIE
  pour Top (isolate 0.305, rank 5, no thermals): 35.5,17.75 arc90 17.75,35.5 arc90 0,17.75 arc90 17.75,0 arc90
BRAKE_LED_DRIVER:DIM_BRAKE_DRAIN
  pour Bottom (isolate 0.406, no thermals): 25.25,12 23.38,12 23.38,19 25.25,19
  pour Bottom (isolate 0.406, no thermals): 23.38,18.88 23.38,20 25.25,21.88 25.25,23.25 26.62,23.25 26.62,21.38 25.62,20.38 25.62,18.88
  pour Bottom (isolate 0.406, no thermals): 25.25,35.27 37.5,35.25 38,35.25 38,-3.75 25.25,-3.75
BRAKE_LED_DRIVER:DIM_BRAKE_GATE
  Bottom 0.25: IC507.3G 22.2,12.28 21.48,13 IC506.DRV
BRAKE_LED_DRIVER:LED_AN  (via drill 0.35)
  other vias: 16.25,19 16.25,16.5 16.25,17.75 15.25,19 15.25,17.75 15.25,16.5 15.75,18.25 15.75,17.25
  pour Top (no thermals): 16.62,19.38 14.75,19.38 14.75,16.12 16.62,16.12
  pour Bottom (no thermals): 14.75,16.12 14.75,23.88 16.62,23.88 16.62,16.12
  pour Bottom (no thermals): 18.62,13.25 18.62,12.75 16,12.75 14.75,14 14.75,16.25 16.62,16.25 16.62,14.12 17.5,13.25
BRAKE_LED_DRIVER:LED_CA  (via drill 0.35)
  Bottom 0.5: L501.P$1 v20.25,17.75
  other vias: 19.25,19 19.25,17.75 19.25,16.5 20.25,19 20.25,16.5 19.75,17.25 19.75,18.25
  pour Top (no thermals): 18.88,19.38 20.75,19.38 20.75,16.12 18.88,16.12
CAN_H  (via drill 0.35)
  Top 0.25: R403.2 v7.5,15.99
  Bottom 0.25: IC401.P$7 6.82,14.31 7.5,14.99 v7.5,15.99 7.5,17.15 IC402.2 9.05,17.2 TP105.P$1
CAN_INFRA:H  (via drill 0.35)
  Top 0.25: v7.5,18.51 R403.1
  Bottom 0.25: R402.2 8.46,18.51 v7.5,18.51
CAN_INFRA:L  (via drill 0.35)
  Top 0.25: v5.5,18.51 R404.1
  Bottom 0.25: R401.1 4.54,18.51 v5.5,18.51
CAN_INFRA:SPLIT
  Bottom 0.25: R401.2 6.45,20.45 | 6.45,20.45 C401.1 | R402.1 6.45,20.45
CAN_L  (via drill 0.35)
  Top 0.25: R404.2 v5.5,15.99
  Bottom 0.25: IC401.P$6 6.18,14.31 5.5,14.99 v5.5,15.99 5.5,17.15 IC402.1 4.45,17.2 TP106.P$1
CAN_RX  (via drill 0.35)
  Route3 0.25: v18.5,7.75 18.5,8 15.5,11 14.25,11 11.25,14 7.75,14 5.35,11.6 v5.35,10.77
  Bottom 0.25: IC401.P$4 5.53,10.95 v5.35,10.77 | v18.5,7.75 18.5,7.73 18.73,7.5 IC302.19_PA9-[PA11]
CAN_TX  (via drill 0.35)
  Route3 0.25: v17.75,7 16,7 15.62,7.38 12.88,7.38 12,6.5 11,6.5 7.75,9.75 v7.75,10.75
  Bottom 0.25: IC302.20_PA10-[PA12] v17.75,7 | IC401.P$1 7.7,10.75 v7.75,10.75
CLEAR
  cutout Route2: 12.05,30.15 16.45,30.15 16.45,26.25 12.05,26.25
CUT
  cutout Bottom: 29.75,20.25 29.75,15.25 arc-90 28.75,14.25 27,14.25 arc-90 26,15.25 26,20.25 arc-90 27,21.25 28.75,21.25 arc-90
DIM_BRAKE  (via drill 0.35)
  Route15 0.4: v18.75,11 18.84,11.09 18.84,13.31 v18.25,13.9
  Bottom 0.25: IC302.12_PA6 18.25,10.73 18.52,11 v18.75,11 | IC506.DIM 18.27,13.92 v18.25,13.9
DIM_REAR  (via drill 0.35)
  Route3 0.25: v18.75,4.5 18.75,6.66 20,7.91 20,12 19.5,12.5 18,12.5 17.5,13 17.5,21.25 11.45,27.3 v11.45,28.5
  Bottom 0.25: IC601.DIM R601.2 v11.45,28.5 | v18.75,4.5 IC302.23_PA15
GND  (via drill 0.35)
  other vias: 27.24,16.48 11.6,9 23.65,7.5 18.75,9 15.85,12 21.75,15.25 21,15.25 20.25,15.25 21,14.5 21.75,14.5 20.25,14.5 19.5,14.5 19.5,15.25 7.75,22.25 11.6,7.5 9,25.05 11.5,25.75 11.5,18 12.55,28.5 23.65,9 12.25,18 10.75,18 6.5,19.1 6.5,15.25 15.75,28.25 15,28.25 14.25,28.25 13.5,28.25 12.85,13.75 16.5,26 22.25,26 13.5,15.75
  pour Bottom (isolate 0.254, rank 3): 35.5,17.75 arc90 17.75,35.5 arc90 0,17.75 arc90 17.75,0 arc90
  pour Bottom (no thermals): 23,13.75 19,13.75 19,15.75 23,15.75
  pour Bottom (no thermals): 22,14.5 22,12.75 23,12.75 23,14.5
  cutout Route2 (rank 2): 18.5,19.75 21,19.75 21,15.75 18.5,15.75
  cutout Route2: 14.5,19.75 17,19.75 17,15.75 14.5,15.75
  pour Route14 (isolate 0.406, rank 6): 35.5,17.75 arc90 17.75,35.5 arc90 0,17.75 arc90 17.75,0 arc90
  pour Route3 (isolate 0.406, rank 6): 35.5,17.75 arc90 17.75,35.5 arc90 0,17.75 arc90 17.75,0 arc90
  cutout Route2 (rank 2): 18.75,13.75 18.75,16 22.5,16 22.5,13.75
  cutout Route3: 18.5,19.75 21,19.75 21,15.75 18.5,15.75
  cutout Route3: 14.5,19.75 17,19.75 17,15.75 14.5,15.75
  cutout Route3: 12.75,26.25 12.75,27.75 20.5,27.75 20.5,26.25
  cutout Route14: 12.75,26.25 12.75,27.75 20.5,27.75 20.5,26.25
  cutout Route14: 14.5,19.75 17,19.75 17,15.75 14.5,15.75
  cutout Route14: 18.5,19.75 21,19.75 21,15.75 18.5,15.75
I2C_SCL  (via drill 0.35)
  Route15 0.25: v13.05,6.25 11.55,6.25 10.75,7.05 10.75,14 v14,17.25
  Bottom 0.25: IC302.3_PF1 15,7.5 13.75,6.25 v13.05,6.25 R302.1 | IC701.SCL 13.9,17.15 v14,17.25
I2C_SDA  (via drill 0.35)
  Route15 0.25: v13.05,5 12.8,5.25 11.25,5.25 10,6.5 10,14.25 v13,17.25
  Bottom 0.25: IC302.2_PF0 15.25,7 14.5,6.25 14.5,5.5 14,5 v13.05,5 R301.1 | IC701.SDA 13.1,17.15 v13,17.25
POWER_3V3:CD
  Bottom 0.25: IC201.5_CD 20.8,27.45 C201.1
POWER_3V3:EN
  Bottom 0.25: IC202.EN 19.25,25.05 | 19.25,25.05 IC201.4_DOUT | R201.2 19.25,25.05
REAR_LED_DRIVER:CS
  Bottom 0.5: IC601.CS R602.1
REAR_LED_DRIVER:D1,D2  (via drill 0.35)
  Top 0.5: D602.2 v29.75,9 | v23.5,5.25 23.5,5.55 D601.4
  Route15 0.5: v23.5,5.25 v29.75,9
REAR_LED_DRIVER:D2,D3  (via drill 0.35)
  Top 0.5: D603.2 32.62,18.8 v32.62,18.75 | D602.4 v29.99,12.49 v30,12.5
  Route15 0.5: v32.62,18.75 v30,12.5
REAR_LED_DRIVER:D4,D5  (via drill 0.35)
  Top 0.5: D605.2 v7,9.75 | D604.4 v11.25,4.37 v11.25,4.38
  Route15 0.5: v7,9.75 7,7.38 10,4.38 v11.25,4.38
REAR_LED_DRIVER:D5,D6  (via drill 0.35)
  Top 0.5: v3.25,20.75 4.4,19.6 D606.2 | D605.4 4.25,11.57 v4.25,11.5
  Route15 0.5: v3.25,20.75 1.75,19.25 1.75,12.75 3,11.5 v4.25,11.5
REAR_LED_DRIVER:D7,D8  (via drill 0.35)
  Top 0.5: D607.4 9.39,30.02 v9.38,30
  Route15 0.5: v9.38,30 D608.2
  other vias: 16.25,31
REAR_LED_DRIVER:D8,D9  (via drill 0.35)
  Top 0.5: D609.2 25.11,28.89 v25,29
  Route15 0.5: D608.4 v25,29
  other vias: 19.25,32.5
REAR_LED_DRIVER:SINK  (via drill 0.35)
  Top 0.5: D609.4 v28.5,28 | D603.4 30.5,21.62 v30.5,21.75 | D606.4 3.45,21.82 v3.5,21.88
  Route15 0.5: v3.5,21.88 2.25,22.25 arc-120 29.75,28.75 v28.5,28 v30.5,21.75
  Bottom 0.5: v3.5,21.88 5.12,23.5 10.53,23.5 10.55,23.52 IC601.SINK
SYS_NRST  (via drill 0.35)
  Top 0.25: SWD1.3_T_NRST
  Route2 0.4: v16.5,8 18.25,9.75 20.5,9.75 24.5,13.75 24.5,15.73 26.52,17.75 SWD1.3_T_NRST
  Bottom 0.25: v16.5,8 IC302.4_NRST 14.25,8 13.75,7.5 C307.2
  other vias: 27.24,17.75
SYS_SWCLK  (via drill 0.35)
  Route3 0.25: v20.25,5.75 21.75,5.75 22.5,6.5 26,6.5 27.75,8.25 27.75,12.25 29.75,14.25 30.5,14.25 31.25,15 31.25,17 30.51,17.75 v28.51,17.75
  Bottom 0.25: IC302.22_PA14 20.08,5.92 v20.25,5.75
SYS_SWDIO  (via drill 0.35)
  Route3 0.25: v21,6.5 21.5,7 21.5,9.5 25.25,13.25 25.25,17.75 25.84,18.34 27.84,18.34 v28.51,19.02
  Bottom 0.25: v21,6.5 IC302.21_PA13

### Text on the board
Top: Die | Die | Die | Die
Route2: BAT+ | BAT+ | BAT+ | BAT+
Route3: GND | GND | GND | GND
Route14: GND | GND | GND | GND
Route15: 3V3 | 3V3 | 3V3 | 3V3
Bottom: GND | GND | GND | GND
bPlace: GND | BAT+ | L | H
tStop: MJ818 / SuperNova Mini2 / ejovrh rev. 5b
Document: SuperNova Mini2 housing